# Altium project 243-436_PCB-Support-STM32F407.PrjPcb (part 1 of 2)
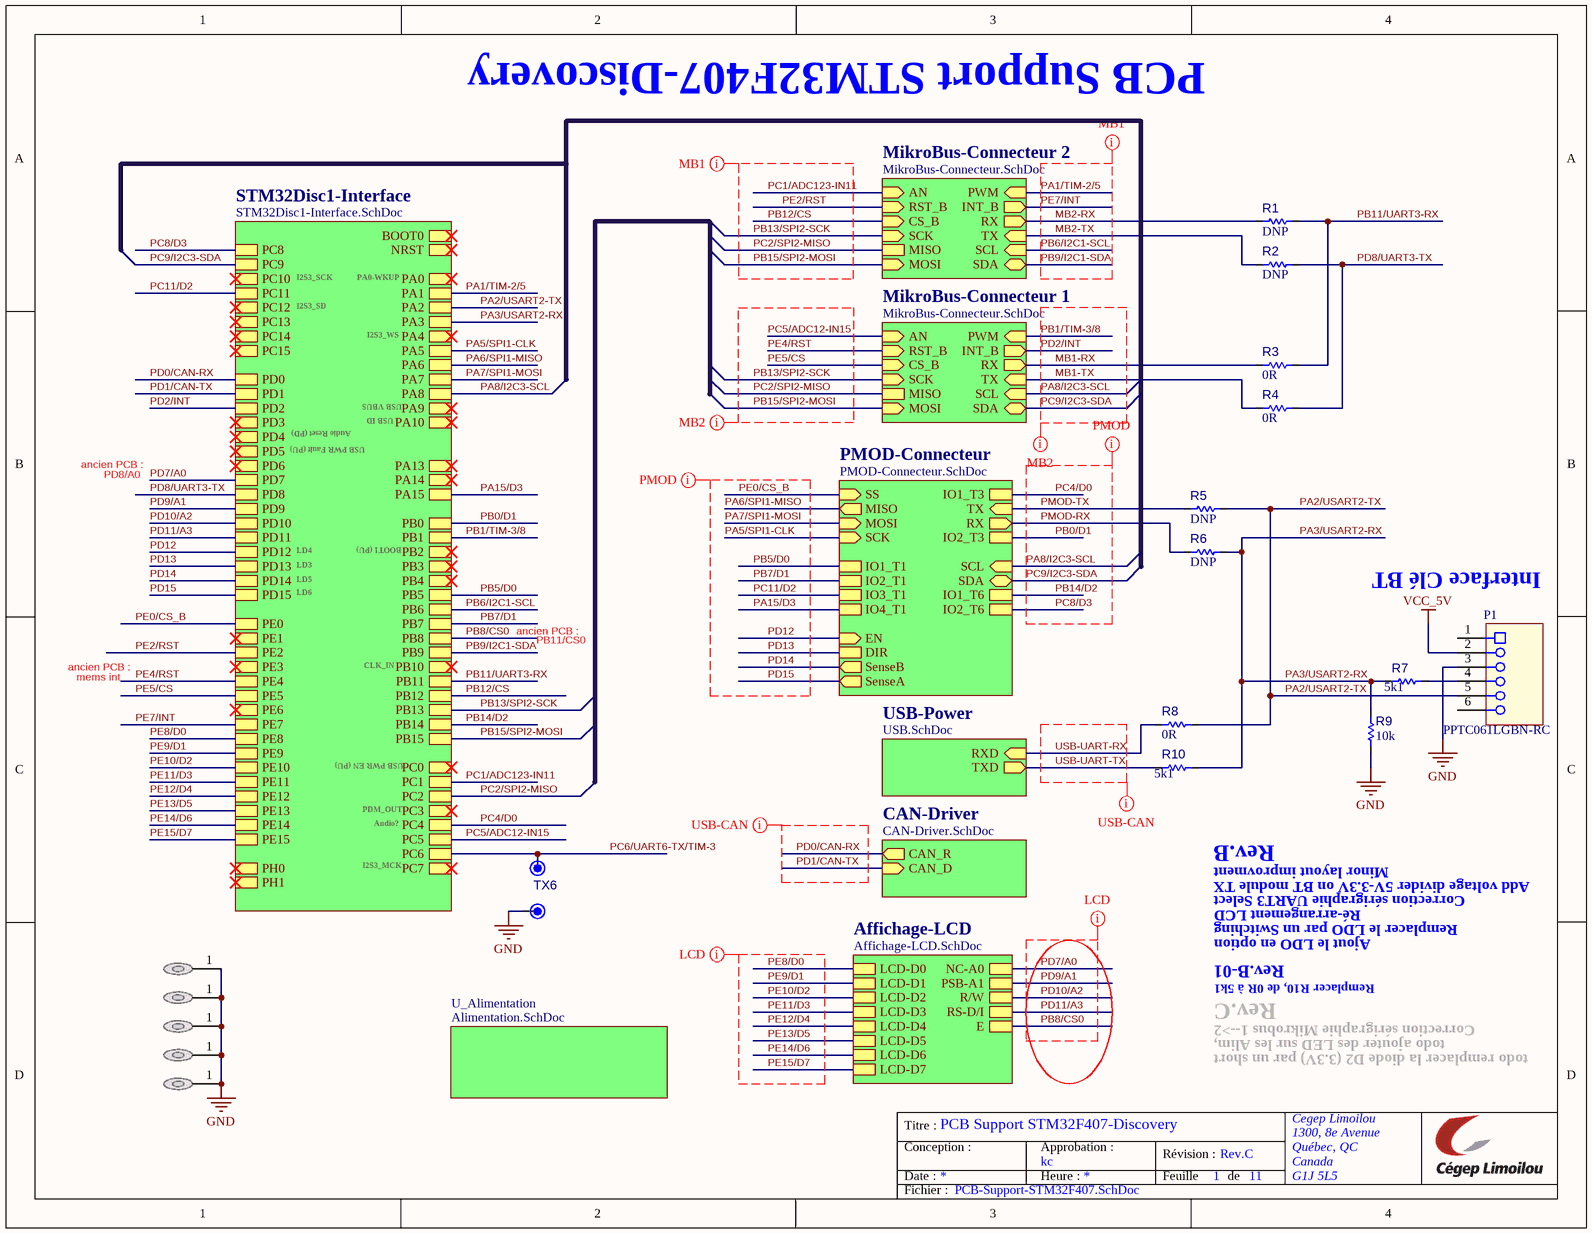
[diagram p0: PCB-Support-STM32F407.SchDoc]
NomDeLetudiant: CEGEP Limoilou; NomDeProjet: STM32F407-Disc-PCB-Support; Revision: Rev.C
11 sheets, 146 parts. Net scope: hierarchical (ports join the sheet entries above them; power ports are global).
Board files: PCB-Support-STM32F407.PcbDoc, PCB-Support-STM32F407-2layers-polygon-EMI.PcbDoc
Sheets:
  PCB-Support-STM32F407.SchDoc
    STM32Disc1-Interface = STM32Disc1-Interface.SchDoc
    MikroBus-Connecteur 2 = MikroBus-Connecteur.SchDoc
    MikroBus-Connecteur 1 = MikroBus-Connecteur.SchDoc
    USB-Power = USB.SchDoc
    CAN-Driver = CAN-Driver.SchDoc
    PMOD-Connecteur = PMOD-Connecteur.SchDoc
    Affichage-LCD = Affichage-LCD.SchDoc
      LCD-Connecteur-KS0108 = LCD-Connecteur-KS0108.SchDoc
      LCD-Connecteur-ST7920 = LCD-Connecteur-ST7920.SchDoc
      Level-Translator1 = Level-Translator.SchDoc
      Level-Translator2 = Level-Translator.SchDoc
    U_Alimentation = Alimentation.SchDoc

## Sheet PCB-Support-STM32F407.SchDoc: PCB Support STM32F407-Discovery
size Letter; ApprovedBy: kc; Author: CEGEP Limoilou; Organization: Cegep Limoilou; Address1: 1300, 8e Avenue; Address2: Québec, QC; Address3: Canada; Address4: G1J 5L5; SheetNumber: 1; SheetTotal: 11

### Parts
(Parts that share a designator on the sheet are numbered #1, #2 ... from top to bottom, then left to right.)
GND3  GND  [TP_TH061]  (value not drawn)  (no BOM)
MH1  DNP  [MP_M-Hole_#4-40_LOOSE-FIT]  (value not drawn)  (no BOM)
MH2  DNP  [MP_M-Hole_#4-40_LOOSE-FIT]  (value not drawn)  (no BOM)
MH3  DNP  [MP_M-Hole_#4-40_LOOSE-FIT]  (value not drawn)  (no BOM)
MH4  DNP  [MP_M-Hole_#4-40_LOOSE-FIT]  (value not drawn)  (no BOM)
MH5  DNP  [MP_M-Hole_#4-40_LOOSE-FIT]  (value not drawn)  (no BOM)
P1  PPTC061LGBN-RC  [P_CONN_HDR_1ROW_6POS_RA_100MIL]
R1  value DNP  [R_1005[0402]]  (hidden comment: Res 0R 0402)  (no BOM)
R2  value DNP  [R_1005[0402]]  (hidden comment: Res 0R 0402)  (no BOM)
R3  value 0R  [R_1005[0402]]  (hidden comment: Res 0R 0402)
R4  value 0R  [R_1005[0402]]  (hidden comment: Res 0R 0402)
R5  value DNP  [R_1005[0402]]  (hidden comment: Res 0R 0402)  (no BOM)
R6  value DNP  [R_1005[0402]]  (hidden comment: Res 0R 0402)  (no BOM)
R7  value 5k1  [R_1005[0402]]  (hidden comment: Res 5k1 1% 0402)
R8  value 0R  [R_1005[0402]]  (hidden comment: Res 0R 0402)
R9  value 10k  [R_1005[0402]]  (hidden comment: Res 10k 1% 0402)
R10#1  value 5k1  [R_1005[0402]]  (hidden comment: Res 5k1 1% 0402)
TX6  DNP  [TP_TH061]  (value not drawn)  (no BOM)

### Sub-sheets
Affichage-LCD = Affichage-LCD.SchDoc: LCD-D0, LCD-D1, LCD-D2, LCD-D3, LCD-D4, LCD-D5, LCD-D6, LCD-D7, NC-A0, PSB-A1, R/W, RS-D/I, E
CAN-Driver = CAN-Driver.SchDoc: CAN_D (in), CAN_R (out)
MikroBus-Connecteur 1 = MikroBus-Connecteur.SchDoc: AN (in), RST_B (in), CS_B (in), SCK (in), MISO, MOSI (in), PWM (in), INT_B (out), RX (out), TX (in), SCL (in), SDA (bidir)
MikroBus-Connecteur 2 = MikroBus-Connecteur.SchDoc: AN (in), RST_B (in), CS_B (in), SCK (in), MISO, MOSI (in), PWM (in), INT_B (out), RX (out), TX (in), SCL (in), SDA (bidir)
PMOD-Connecteur = PMOD-Connecteur.SchDoc: SS (in), MOSI (in), SCK (in), MISO (out), TX (in), RX (out), SCL (in), SDA (bidir), IO1_T3, IO2_T3, IO1_T6, IO2_T6, EN (in), SenseA (out), DIR, SenseB (out), IO1_T1, IO2_T1, IO3_T1, IO4_T1
STM32Disc1-Interface = STM32Disc1-Interface.SchDoc: BOOT0, NRST, PA0, PA1, PA2, PA3, PA4, PA5, PA6, PA7, PA8, PA9, PA10, PA13, PA14, PA15, PB0, PB1, PB2, PB3, PB4, PB5, PB6, PB7, PB8, PB9, PB10, PB11, PB12, PB13, PB14, PB15, PC0, PC1, PC2, PC3, PC4, PC5, PC6, PC7, PC8, PC9, PC10, PC11, PC12, PC13, PC14, PC15, PD0, PD1, PD2, PD3, PD4, PD5, PD6, PD7, PD8, PD9, PD10, PD11, PD12, PD13, PD14, PD15, PE0, PE1, PE2, PE3, PE4, PE5, PE6, PE7, PE8, PE9, PE10, PE11, PE12, PE13, PE14, PE15, PH0, PH1
U_Alimentation = Alimentation.SchDoc: no entries
USB-Power = USB.SchDoc: RXD (in), TXD (out)

### Nets
GND: GND3.1 MH1.1 MH2.1 MH3.1 MH4.1 MH5.1 P1.3 R9.1
VCC_5V: P1.2
MB1-RX: R3.1 ; sheet MikroBus-Connecteur 1/RX
MB1-TX: R4.1 ; sheet MikroBus-Connecteur 1/TX
MB2-RX: R1.1 ; sheet MikroBus-Connecteur 2/RX
MB2-TX: R2.1 ; sheet MikroBus-Connecteur 2/TX
PA1/TIM-2/5: sheet STM32Disc1-Interface/PA1, sheet MikroBus-Connecteur 2/PWM
PA2/USART2-TX: P1.5 R5.2 R8.2 ; sheet STM32Disc1-Interface/PA2
PA3/USART2-RX: R6.2 R7.1 R9.2 R10#1.2 ; sheet STM32Disc1-Interface/PA3
PA5/SPI1-CLK: sheet STM32Disc1-Interface/PA5, sheet PMOD-Connecteur/SCK
PA6/SPI1-MISO: sheet STM32Disc1-Interface/PA6, sheet PMOD-Connecteur/MISO
PA7/SPI1-MOSI: sheet STM32Disc1-Interface/PA7, sheet PMOD-Connecteur/MOSI
PA8/I2C3-SCL: sheet STM32Disc1-Interface/PA8, sheet MikroBus-Connecteur 1/SCL, sheet PMOD-Connecteur/SCL
PA15/D3: sheet STM32Disc1-Interface/PA15, sheet PMOD-Connecteur/IO4_T1
PB0/D1: sheet STM32Disc1-Interface/PB0, sheet PMOD-Connecteur/IO2_T3
PB1/TIM-3/8: sheet STM32Disc1-Interface/PB1, sheet MikroBus-Connecteur 1/PWM
PB5/D0: sheet STM32Disc1-Interface/PB5, sheet PMOD-Connecteur/IO1_T1
PB6/I2C1-SCL: sheet STM32Disc1-Interface/PB6, sheet MikroBus-Connecteur 2/SCL
PB7/D1: sheet STM32Disc1-Interface/PB7, sheet PMOD-Connecteur/IO2_T1
PB8/CS0: sheet STM32Disc1-Interface/PB8, sheet Affichage-LCD/E
PB9/I2C1-SDA: sheet STM32Disc1-Interface/PB9, sheet MikroBus-Connecteur 2/SDA
PB11/UART3-RX: R1.2 R3.2 ; sheet STM32Disc1-Interface/PB11
PB12/CS: sheet STM32Disc1-Interface/PB12, sheet MikroBus-Connecteur 2/CS_B
PB13/SPI2-SCK: sheet STM32Disc1-Interface/PB13, sheet MikroBus-Connecteur 2/SCK, sheet MikroBus-Connecteur 1/SCK
PB14/D2: sheet STM32Disc1-Interface/PB14, sheet PMOD-Connecteur/IO1_T6
PB15/SPI2-MOSI: sheet STM32Disc1-Interface/PB15, sheet MikroBus-Connecteur 2/MOSI, sheet MikroBus-Connecteur 1/MOSI
PC1/ADC123-IN11: sheet STM32Disc1-Interface/PC1, sheet MikroBus-Connecteur 2/AN
PC2/SPI2-MISO: sheet STM32Disc1-Interface/PC2, sheet MikroBus-Connecteur 2/MISO, sheet MikroBus-Connecteur 1/MISO
PC4/D0: sheet STM32Disc1-Interface/PC4, sheet PMOD-Connecteur/IO1_T3
PC5/ADC12-IN15: sheet STM32Disc1-Interface/PC5, sheet MikroBus-Connecteur 1/AN
PC6/UART6-TX/TIM-3: TX6.1 ; sheet STM32Disc1-Interface/PC6
PC8/D3: sheet STM32Disc1-Interface/PC8, sheet PMOD-Connecteur/IO2_T6
PC9/I2C3-SDA: sheet STM32Disc1-Interface/PC9, sheet MikroBus-Connecteur 1/SDA, sheet PMOD-Connecteur/SDA
PC11/D2: sheet STM32Disc1-Interface/PC11, sheet PMOD-Connecteur/IO3_T1
PD0/CAN-RX: sheet STM32Disc1-Interface/PD0, sheet CAN-Driver/CAN_R
PD1/CAN-TX: sheet STM32Disc1-Interface/PD1, sheet CAN-Driver/CAN_D
PD2/INT: sheet STM32Disc1-Interface/PD2, sheet MikroBus-Connecteur 1/INT_B
PD7/A0: sheet STM32Disc1-Interface/PD7, sheet Affichage-LCD/NC-A0
PD8/UART3-TX: R2.2 R4.2 ; sheet STM32Disc1-Interface/PD8
PD9/A1: sheet STM32Disc1-Interface/PD9, sheet Affichage-LCD/PSB-A1
PD10/A2: sheet STM32Disc1-Interface/PD10, sheet Affichage-LCD/R/W
PD11/A3: sheet STM32Disc1-Interface/PD11, sheet Affichage-LCD/RS-D/I
PD12: sheet STM32Disc1-Interface/PD12, sheet PMOD-Connecteur/EN
PD13: sheet STM32Disc1-Interface/PD13, sheet PMOD-Connecteur/DIR
PD14: sheet STM32Disc1-Interface/PD14, sheet PMOD-Connecteur/SenseB
PD15: sheet STM32Disc1-Interface/PD15, sheet PMOD-Connecteur/SenseA
PE0/CS_B: sheet STM32Disc1-Interface/PE0, sheet PMOD-Connecteur/SS
PE2/RST: sheet STM32Disc1-Interface/PE2, sheet MikroBus-Connecteur 2/RST_B
PE4/RST: sheet STM32Disc1-Interface/PE4, sheet MikroBus-Connecteur 1/RST_B
PE5/CS: sheet STM32Disc1-Interface/PE5, sheet MikroBus-Connecteur 1/CS_B
PE7/INT: sheet STM32Disc1-Interface/PE7, sheet MikroBus-Connecteur 2/INT_B
PE8/D0: sheet STM32Disc1-Interface/PE8, sheet Affichage-LCD/LCD-D0
PE9/D1: sheet STM32Disc1-Interface/PE9, sheet Affichage-LCD/LCD-D1
PE10/D2: sheet STM32Disc1-Interface/PE10, sheet Affichage-LCD/LCD-D2
PE11/D3: sheet STM32Disc1-Interface/PE11, sheet Affichage-LCD/LCD-D3
PE12/D4: sheet STM32Disc1-Interface/PE12, sheet Affichage-LCD/LCD-D4
PE13/D5: sheet STM32Disc1-Interface/PE13, sheet Affichage-LCD/LCD-D5
PE14/D6: sheet STM32Disc1-Interface/PE14, sheet Affichage-LCD/LCD-D6
PE15/D7: sheet STM32Disc1-Interface/PE15, sheet Affichage-LCD/LCD-D7
PMOD-RX: R6.1 ; sheet PMOD-Connecteur/RX
PMOD-TX: R5.1 ; sheet PMOD-Connecteur/TX
USB-UART-RX: R8.1 ; sheet USB-Power/RXD
USB-UART-TX: R10#1.1 ; sheet USB-Power/TXD
NetP1_4: P1.4 R7.2

Not connected (* = marked no-connect by the designer): P1 1 6

### Layout directives
net class USB-CAN: PD0/CAN-RX, PD1/CAN-TX, USB-UART-RX, USB-UART-TX
net class LCD: PB8/CS0, PD7/A0, PD9/A1, PD10/A2, PD11/A3, PE8/D0, PE9/D1, PE10/D2, PE11/D3, PE12/D4, PE13/D5, PE14/D6, PE15/D7
net class PMOD: PA5/SPI1-CLK, PA6/SPI1-MISO, PA7/SPI1-MOSI, PA8/I2C3-SCL, PA15/D3, PB0/D1, PB5/D0, PB7/D1, PB14/D2, PC4/D0, PC8/D3, PC9/I2C3-SDA, PC11/D2, PD12, PD13, PD14, PD15, PE0/CS_B, PMOD-RX, PMOD-TX
net class MB2: MB1-RX, MB1-TX, PA8/I2C3-SCL, PB1/TIM-3/8, PB13/SPI2-SCK, PB15/SPI2-MOSI, PC2/SPI2-MISO, PC5/ADC12-IN15, PC9/I2C3-SDA, PD2/INT, PE4/RST, PE5/CS
net class MB1: MB2-RX, MB2-TX, PA1/TIM-2/5, PB6/I2C1-SCL, PB9/I2C1-SDA, PB12/CS, PB13/SPI2-SCK, PB15/SPI2-MOSI, PC1/ADC123-IN11, PC2/SPI2-MISO, PE2/RST, PE7/INT

### Notes on the sheet
- I2S3_SCK
- I2S3_SD
- PA0-WKUP
- I2S3_WS
- PD8/A0
- ancien PCB :
- USB PWR Fault (PU)
- Audio Reset (PD)
- USB VBUS
- USB ID
- LD3
- LD4
- LD5
- LD6
- BOOT1 (PU)
- (near P1) Interface Clé BT
- mems int
- CLK_IN
- PB11/CS0
- USB PWR EN (PU)
- PDM_OUT
- Audio?
- I2S3_MCK
- Rev.B
- Minor layout improvment
- Add voltage divider 5V-3.3V on BT module TX
- Correction sérigraphie UART3 Select
- Ré-arrangement LCD
- Remplacer le LDO par un Switching
- Ajout le LDO en option
- Rev.C
- Correction sérigraphie Mikrobus 1-->2
- Rev.B-01
- Remplacer R10, de 0R à 5k1
- todo ajouter des LED sur les Alim,
- todo remplacer la diode D2 (3.3V) par un short
- Titre :
- Conception :
- Date :
- Approbation :
- Heure :
- Révision :
- Feuille
- de
- Fichier :

### Library data of the parts
GND3 = TP_TH0.61mm(AWG28): Pad TH 0.61mm diameter (AWG28); Value: DNP; Manufacturer Part Number 1: DNP; Supplier Part Number 1: N/A; Supplier 1: N/A
MH1-MH5 = MH-4-40: Mounting Hole #4-40 w/ Flat Washer; Manufacturer Part Number 1: DNP; Value: DNP; Supplier Part Number 1: N/A
P1 = CONN-100MIL-SKT-01X06_RA: CONN SOCKET 6pos 100mils Right Angle; Manufacturer 1: Megastar; Manufacturer Part Number 1: ZX-PM2.54-1-6PWZ; Mounting Technology: TH; Manufacturer 2: Sullins; Manufacturer Part Number 2: PPTC061LGBN-RC; Supplier 1: LCSC; Supplier Part Number 1: C49326178; Manufacturer 3: Samtec; Manufacturer Part Number 3: SSW-106-02-T-S-RA; Supplier 2: Digikey; Supplier Part Number 2: S5442-ND
R1-R6 R8 = RES005: Resistor type 1; Manufacturer 1: Yageo; Manufacturer Part Number 1: RC0402JR-070RL; LibRef: RES005; Max Working Voltage: 50V; Mounting Technology: SMT; Supplier 1: LCSC; Supplier Part Number 1: C60485
R7 R10#1 = RES010: Resistor type 1; Manufacturer 1: Panasonic; Manufacturer Part Number 1: ERJ-2RKF5101X; LibRef: RES010; Puissance: 1/16W; Max Working Voltage: 50V; Tolerance: 1%; Mounting Technology: SMT; Supplier 1: LCSC; Supplier Part Number 1: C25905
R9 = RES003: Resistor type 1; Manufacturer 1: Vishay; Manufacturer Part Number 1: CR0402F1002T1LF; LibRef: RES003; Puissance: 1/16W; Max Working Voltage: 50V; Tolerance: 1%; Mounting Technology: SMT; Supplier 1: Digikey; Supplier Part Number 1: 541-10.0KLCT-ND
TX6 = TP_TH0.61mm(AWG28): Pad TH 0.61mm diameter (AWG28); Value: DNP; Manufacturer Part Number 1: DNP; Supplier Part Number 1: N/A; Supplier 1: N/A

## Sheet STM32Disc1-Interface.SchDoc: STM32 DISCOVERY 407
size Letter; ApprovedBy: APPROUVÉ PAR; Author: CEGEP Limoilou; Organization: Cegep Limoilou; Address1: 1300, 8e Avenue; Address2: Québec, QC; Address3: Canada; Address4: G1J 5L5; SheetNumber: 3; SheetTotal: 8
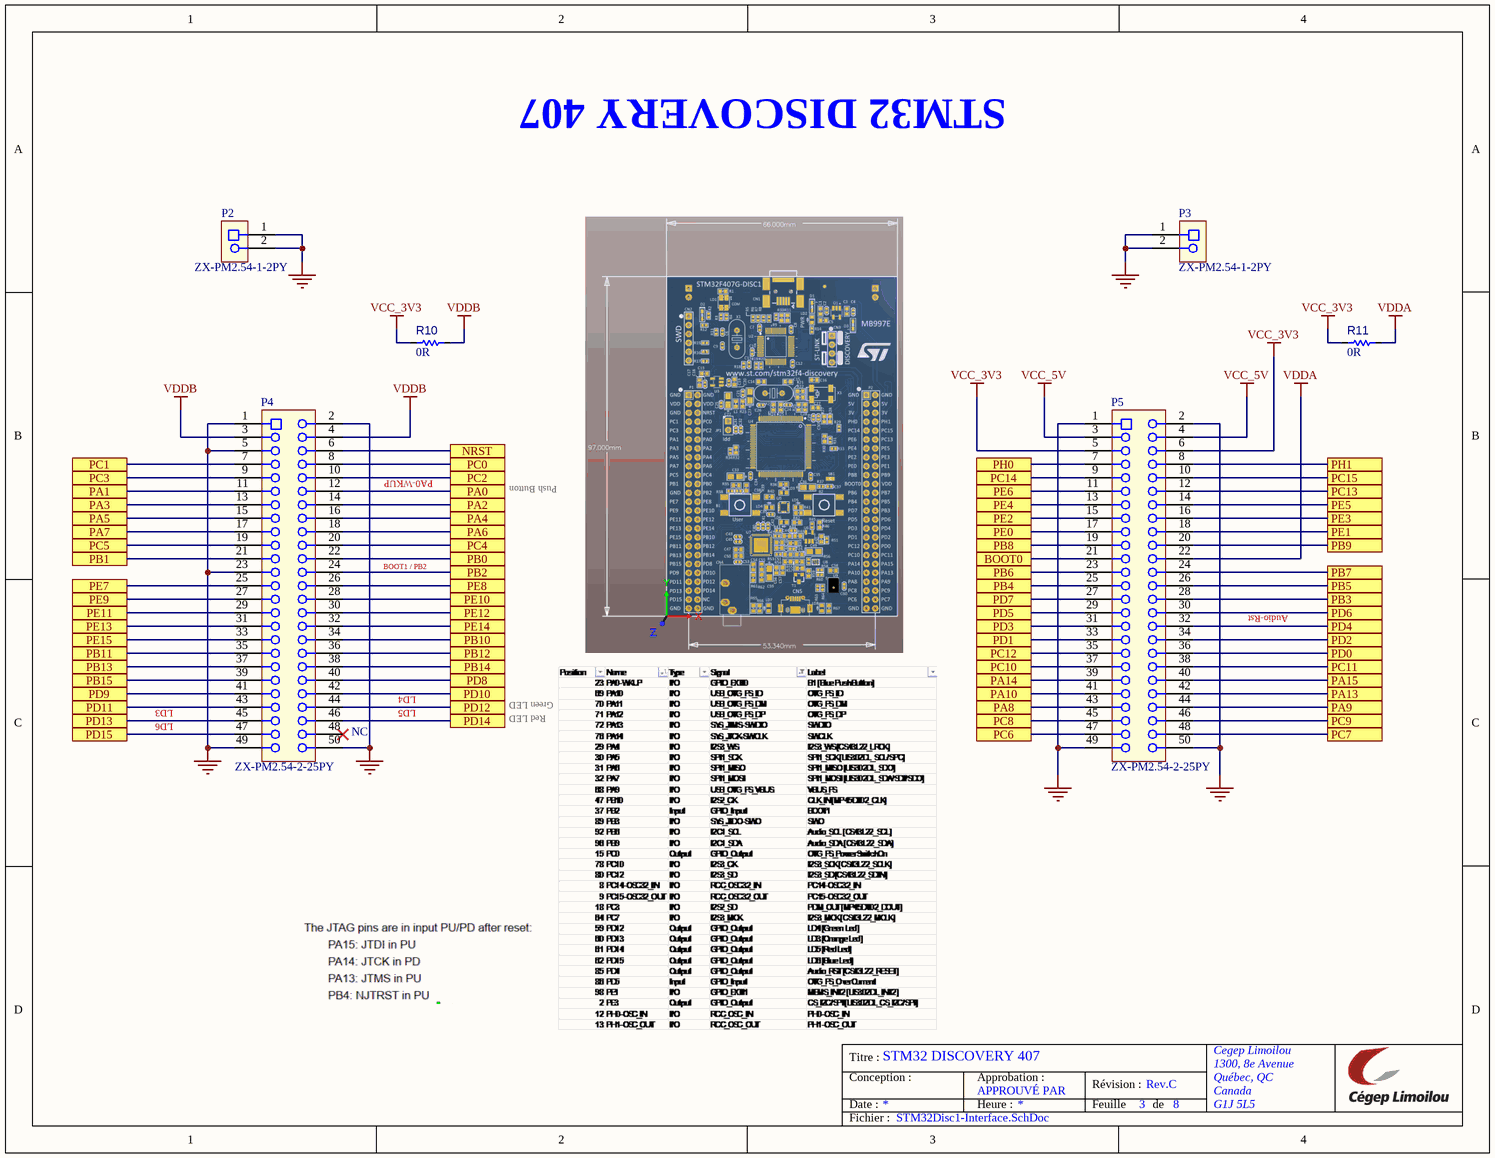
[diagram p1: STM32Disc1-Interface.SchDoc]

### Parts
(Parts that share a designator on the sheet are numbered #1, #2 ... from top to bottom, then left to right.)
P2  ZX-PM2.54-1-2PY  [CONN_SKT_2POS_100MILS_TH]
P3  ZX-PM2.54-1-2PY  [CONN_SKT_2POS_100MILS_TH]
P4  ZX-PM2.54-2-25PY  [CONN-HEAD02X25-100MIL]
P5  ZX-PM2.54-2-25PY  [CONN-HEAD02X25-100MIL]
R10#2  value 0R  [R_1005[0402]]  (hidden comment: Res 0R 0402)
R11  value 0R  [R_1005[0402]]  (hidden comment: Res 0R 0402)

### Ports
BOOT0 (see PCB-Support-STM32F407[2A]), NRST (see PCB-Support-STM32F407[2A]), PA0 (see PCB-Support-STM32F407[2A]), PA1 (see PCB-Support-STM32F407[2A]), PA2 (see PCB-Support-STM32F407[2A]), PA3 (see PCB-Support-STM32F407[2B]), PA4 (see PCB-Support-STM32F407[2B]), PA5 (see PCB-Support-STM32F407[2B]), PA6 (see PCB-Support-STM32F407[2B]), PA7 (see PCB-Support-STM32F407[2B]), PA8 (see PCB-Support-STM32F407[2B]), PA9 (see PCB-Support-STM32F407[2B]), PA10 (see PCB-Support-STM32F407[2B]), PA13 (see PCB-Support-STM32F407[2B]), PA14 (see PCB-Support-STM32F407[2B]), PA15 (see PCB-Support-STM32F407[2B]), PB0 (see PCB-Support-STM32F407[2B]), PB1 (see PCB-Support-STM32F407[2B]), PB2 (see PCB-Support-STM32F407[2B]), PB3 (see PCB-Support-STM32F407[2B]), PB4 (see PCB-Support-STM32F407[2B]), PB5 (see PCB-Support-STM32F407[2B]), PB6 (see PCB-Support-STM32F407[2B]), PB7 (see PCB-Support-STM32F407[2C]), PB8 (see PCB-Support-STM32F407[2C]), PB9 (see PCB-Support-STM32F407[2C]), PB10 (see PCB-Support-STM32F407[2C]), PB11 (see PCB-Support-STM32F407[2C]), PB12 (see PCB-Support-STM32F407[2C]), PB13 (see PCB-Support-STM32F407[2C]), PB14 (see PCB-Support-STM32F407[2C]), PB15 (see PCB-Support-STM32F407[2C]), PC0 (see PCB-Support-STM32F407[2C]), PC1 (see PCB-Support-STM32F407[2C]), PC2 (see PCB-Support-STM32F407[2C]), PC3 (see PCB-Support-STM32F407[2C]), PC4 (see PCB-Support-STM32F407[2C]), PC5 (see PCB-Support-STM32F407[2C]), PC6 (see PCB-Support-STM32F407[2C]), PC7 (see PCB-Support-STM32F407[2C]), PC8 (see PCB-Support-STM32F407[1A]), PC9 (see PCB-Support-STM32F407[1A]), PC10 (see PCB-Support-STM32F407[1A]), PC11 (see PCB-Support-STM32F407[1A]), PC12 (see PCB-Support-STM32F407[1A]), PC13 (see PCB-Support-STM32F407[1B]), PC14 (see PCB-Support-STM32F407[1B]), PC15 (see PCB-Support-STM32F407[1B]), PD0 (see PCB-Support-STM32F407[1B]), PD1 (see PCB-Support-STM32F407[1B]), PD2 (see PCB-Support-STM32F407[1B]), PD3 (see PCB-Support-STM32F407[1B]), PD4 (see PCB-Support-STM32F407[1B]), PD5 (see PCB-Support-STM32F407[1B]), PD6 (see PCB-Support-STM32F407[1B]), PD7 (see PCB-Support-STM32F407[1B]), PD8 (see PCB-Support-STM32F407[1B]), PD9 (see PCB-Support-STM32F407[1B]), PD10 (see PCB-Support-STM32F407[1B]), PD11 (see PCB-Support-STM32F407[1B]), PD12 (see PCB-Support-STM32F407[1B]), PD13 (see PCB-Support-STM32F407[1B]), PD14 (see PCB-Support-STM32F407[1B]), PD15 (see PCB-Support-STM32F407[1B]), PE0 (see PCB-Support-STM32F407[1C]), PE1 (see PCB-Support-STM32F407[1C]), PE2 (see PCB-Support-STM32F407[1C]), PE3 (see PCB-Support-STM32F407[1C]), PE4 (see PCB-Support-STM32F407[1C]), PE5 (see PCB-Support-STM32F407[1C]), PE6 (see PCB-Support-STM32F407[1C]), PE7 (see PCB-Support-STM32F407[1C]), PE8 (see PCB-Support-STM32F407[1C]), PE9 (see PCB-Support-STM32F407[1C]), PE10 (see PCB-Support-STM32F407[1C]), PE11 (see PCB-Support-STM32F407[1C]), PE12 (see PCB-Support-STM32F407[1C]), PE13 (see PCB-Support-STM32F407[1C]), PE14 (see PCB-Support-STM32F407[1C]), PE15 (see PCB-Support-STM32F407[1C]), PH0 (see PCB-Support-STM32F407[1C]), PH1 (see PCB-Support-STM32F407[1C])

### Nets
GND: P2.1 P2.2 P3.1 P3.2 P4.1 P4.2 P4.5 P4.23 P4.49 P4.50 P5.1 P5.2 P5.49 P5.50
VCC_3V3: P5.5 P5.6 R10#2.1 R11.1
VCC_5V: P5.3 P5.4
VDDA: P5.22 R11.2
VDDB: P4.3 P4.4 R10#2.2
PA1/TIM-2/5: P4.11 ; port PA1
PA2/USART2-TX: P4.14 ; port PA2
PA3/USART2-RX: P4.13 ; port PA3
PA5/SPI1-CLK: P4.15 ; port PA5
PA6/SPI1-MISO: P4.18 ; port PA6
PA7/SPI1-MOSI: P4.17 ; port PA7
PA8/I2C3-SCL: P5.43 ; port PA8
PA15/D3: P5.40 ; port PA15
PB0/D1: P4.22 ; port PB0
PB1/TIM-3/8: P4.21 ; port PB1
PB5/D0: P5.26 ; port PB5
PB6/I2C1-SCL: P5.23 ; port PB6
PB7/D1: P5.24 ; port PB7
PB8/CS0: P5.19 ; port PB8
PB9/I2C1-SDA: P5.20 ; port PB9
PB11/UART3-RX: P4.35 ; port PB11
PB12/CS: P4.36 ; port PB12
PB13/SPI2-SCK: P4.37 ; port PB13
PB14/D2: P4.38 ; port PB14
PB15/SPI2-MOSI: P4.39 ; port PB15
PC1/ADC123-IN11: P4.7 ; port PC1
PC2/SPI2-MISO: P4.10 ; port PC2
PC4/D0: P4.20 ; port PC4
PC5/ADC12-IN15: P4.19 ; port PC5
PC6/UART6-TX/TIM-3: P5.47 ; port PC6
PC8/D3: P5.45 ; port PC8
PC9/I2C3-SDA: P5.46 ; port PC9
PC11/D2: P5.38 ; port PC11
PD0/CAN-RX: P5.36 ; port PD0
PD1/CAN-TX: P5.33 ; port PD1
PD2/INT: P5.34 ; port PD2
PD7/A0: P5.27 ; port PD7
PD8/UART3-TX: P4.40 ; port PD8
PD9/A1: P4.41 ; port PD9
PD10/A2: P4.42 ; port PD10
PD11/A3: P4.43 ; port PD11
PD12: P4.44 ; port PD12
PD13: P4.45 ; port PD13
PD14: P4.46 ; port PD14
PD15: P4.47 ; port PD15
PE0/CS_B: P5.17 ; port PE0
PE2/RST: P5.15 ; port PE2
PE4/RST: P5.13 ; port PE4
PE5/CS: P5.14 ; port PE5
PE7/INT: P4.25 ; port PE7
PE8/D0: P4.26 ; port PE8
PE9/D1: P4.27 ; port PE9
PE10/D2: P4.28 ; port PE10
PE11/D3: P4.29 ; port PE11
PE12/D4: P4.30 ; port PE12
PE13/D5: P4.31 ; port PE13
PE14/D6: P4.32 ; port PE14
PE15/D7: P4.33 ; port PE15
NetP4_6: P4.6 ; port NRST
NetP4_8: P4.8 ; port PC0
NetP4_9: P4.9 ; port PC3
NetP4_12: P4.12 ; port PA0
NetP4_16: P4.16 ; port PA4
NetP4_24: P4.24 ; port PB2
NetP4_34: P4.34 ; port PB10
NetP5_7: P5.7 ; port PH0
NetP5_8: P5.8 ; port PH1
NetP5_9: P5.9 ; port PC14
NetP5_10: P5.10 ; port PC15
NetP5_11: P5.11 ; port PE6
NetP5_12: P5.12 ; port PC13
NetP5_16: P5.16 ; port PE3
NetP5_18: P5.18 ; port PE1
NetP5_21: P5.21 ; port BOOT0
NetP5_25: P5.25 ; port PB4
NetP5_28: P5.28 ; port PB3
NetP5_29: P5.29 ; port PD5
NetP5_30: P5.30 ; port PD6
NetP5_31: P5.31 ; port PD3
NetP5_32: P5.32 ; port PD4
NetP5_35: P5.35 ; port PC12
NetP5_37: P5.37 ; port PC10
NetP5_39: P5.39 ; port PA14
NetP5_41: P5.41 ; port PA10
NetP5_42: P5.42 ; port PA13
NetP5_44: P5.44 ; port PA9
NetP5_48: P5.48 ; port PC7

Not connected (* = marked no-connect by the designer): P4 48*

### Notes on the sheet
- PA0-WKUP
- Push Button
- BOOT1 / PB2
- Audio-Rst
- LD4
- Green LED
- LD3
- LD6
- (near P4) NC
- LD5
- Red LED
- Titre :
- Conception :
- Date :
- Approbation :
- Heure :
- Révision :
- Feuille
- de
- Fichier :

### Library data of the parts
P2 P3 = CONN-100MIL-SKT-01X02: CONN SOCKET 2pins single row , 100mils TH; Manufacturer 1: Megastar; Manufacturer Part Number 1: ZX-PM2.54-1-2PY; Mounting Technology: TH; Supplier 1: LCSC; Supplier Part Number 1: C7499322; Manufacturer 2: Würth Elektronik; Manufacturer Part Number 2: 61300211121
P4 P5 = CONN-100MIL-SKT-02X25: CONN SOCKET 2x25POS, Dual row 100MIL; Manufacturer 1: Megastar; Manufacturer Part Number 1: ZX-PM2.54-2-25PY; Mounting Technology: TH; Manufacturer 2: Sullins; Manufacturer Part Number 2: SFH11-PBPC-D25-ST-BK; Supplier 1: LCSC; Supplier 2: Digikey; Supplier Part Number 1: C7499355; Supplier Part Number 2: S9201-ND
R10#2 R11 = RES005: as R1 on sheet PCB-Support-STM32F407; Mounting Technology: SMT; Supplier 1: LCSC; Supplier Part Number 1: C60485

## Sheet MikroBus-Connecteur.SchDoc: Mikro Bus - Connecteur
size Letter; ApprovedBy: APPROUVÉ PAR; Author: CEGEP Limoilou; Organization: Cegep Limoilou; Address1: 1300, 8e Avenue; Address2: Québec, QC; Address3: Canada; Address4: G1J 5L5; SheetNumber: 3; SheetTotal: 7
Used 2 times, as channels MikroBus-Connecteur 2, MikroBus-Connecteur 1. Parts and nets are listed once, with the designators drawn on the sheet.
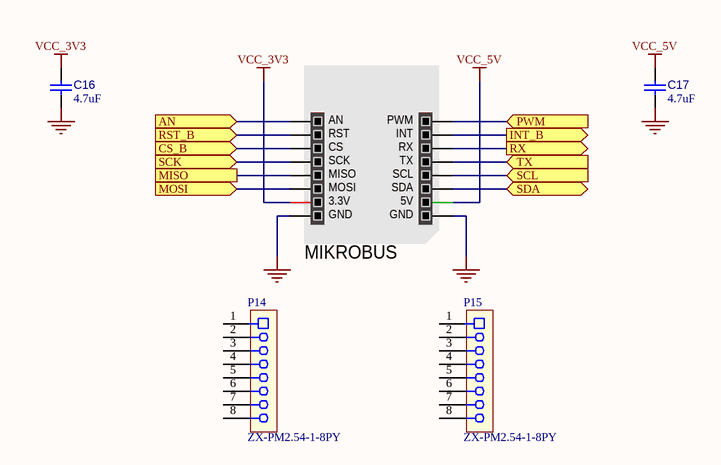
[diagram p2: MikroBus-Connecteur.SchDoc]

### Parts
C16  value 4.7uF  [C_2012[0805]]  (hidden comment: Cap 4.7uF 0805)
C17  value 4.7uF  [C_2012[0805]]  (hidden comment: Cap 4.7uF 0805)
MIKROBUS  MIKROBUS HOST CONN.  [MIKROBUS HOST CONN. TH]  (value not drawn)  (no BOM)
P14  ZX-PM2.54-1-8PY  [CONN_SKT_01X08_100MIL]  (graphical)
P15  ZX-PM2.54-1-8PY  [CONN_SKT_01X08_100MIL]  (graphical)

### Ports
AN (in, see PCB-Support-STM32F407[3B]), CS_B (in, see PCB-Support-STM32F407[3B]), INT_B (out, see PCB-Support-STM32F407[3B]), MISO (see PCB-Support-STM32F407[3B]), MOSI (in, see PCB-Support-STM32F407[3B]), PWM (in, see PCB-Support-STM32F407[3B]), RST_B (in, see PCB-Support-STM32F407[3B]), RX (out, see PCB-Support-STM32F407[3B]), SCK (in, see PCB-Support-STM32F407[3B]), SCL (in, see PCB-Support-STM32F407[3B], PMOD-Connecteur[3C]), SDA (bidir, see PCB-Support-STM32F407[3B], PMOD-Connecteur[3B]), TX (in, see PCB-Support-STM32F407[3B])

### Nets
GND: C16.1 C17.1 MIKROBUS.8(GND) MIKROBUS.9(GND)
VCC_3V3: C16.2 MIKROBUS.7(3.3V)
VCC_5V: C17.2 MIKROBUS.10(5V)
AN: MIKROBUS.1(AN) ; port AN
CS_B: MIKROBUS.3(CS) ; port CS_B
INT_B: MIKROBUS.15(INT) ; port INT_B
MISO: MIKROBUS.5(MISO) ; port MISO
MOSI: MIKROBUS.6(MOSI) ; port MOSI
PWM: MIKROBUS.16(PWM) ; port PWM
RST_B: MIKROBUS.2(RST) ; port RST_B
RX: MIKROBUS.14(RX) ; port RX
SCK: MIKROBUS.4(SCK) ; port SCK
SCL: MIKROBUS.12(SCL) ; port SCL
SDA: MIKROBUS.11(SDA) ; port SDA
TX: MIKROBUS.13(TX) ; port TX

Not connected (* = marked no-connect by the designer): P14 1 2 3 4 5 6 7 8; P15 1 2 3 4 5 6 7 8

### Channels
MikroBus-Connecteur 2: designators C16=C16B C17=C17B MIKROBUS=MIKROBUS1B P14=P14B P15=P15B; ports AN=PC1/ADC123-IN11 CS_B=PB12/CS INT_B=PE7/INT MISO=PC2/SPI2-MISO MOSI=PB15/SPI2-MOSI PWM=PA1/TIM-2/5 RST_B=PE2/RST RX=MB2-RX SCK=PB13/SPI2-SCK SCL=PB6/I2C1-SCL SDA=PB9/I2C1-SDA TX=MB2-TX
MikroBus-Connecteur 1: designators C16=C16A C17=C17A MIKROBUS=MIKROBUS1A P14=P14A P15=P15A; ports AN=PC5/ADC12-IN15 CS_B=PE5/CS INT_B=PD2/INT MISO=PC2/SPI2-MISO MOSI=PB15/SPI2-MOSI PWM=PB1/TIM-3/8 RST_B=PE4/RST RX=MB1-RX SCK=PB13/SPI2-SCK SCL=PA8/I2C3-SCL SDA=PC9/I2C3-SDA TX=MB1-TX

### Notes on the sheet
- Titre :
- Conception :
- Date :
- Approbation :
- Heure :
- Révision :
- Feuille
- de
- Fichier :

### Library data of the parts
C16 C17 = CAP003: Capacitor type 1; Manufacturer 1: Taiyo Yuden; Manufacturer Part Number 1: TMK212AB7475KG-T; LibRef: CAP003; CEGEP: KCOND02SM; Tolerance: 10%; Rated Voltage: 25V; Dielectric: X7R; Supplier 1: LCSC; Supplier Part Number 1: C163186; Mounting Technology: SMT
MIKROBUS = MIKROBUS-HOST-CONN: mikroBUS Host Socket
P14 P15 = CONN-100MIL-SKT-01X08: CONN SOCKET 8pos 100mils; Manufacturer 1: Megastar; Mounting Technology: TH; Manufacturer Part Number 1: ZX-PM2.54-1-8PY; Supplier 1: LCSC; Supplier Part Number 1: C7499328

## Sheet USB.SchDoc: Interface USB et CAN
size Letter; ApprovedBy: APPROUVÉ PAR; Author: CEGEP Limoilou; Organization: Cegep Limoilou; Address1: 1300, 8e Avenue; Address2: Québec, QC; Address3: Canada; Address4: G1J 5L5; SheetNumber: 7; SheetTotal: 7
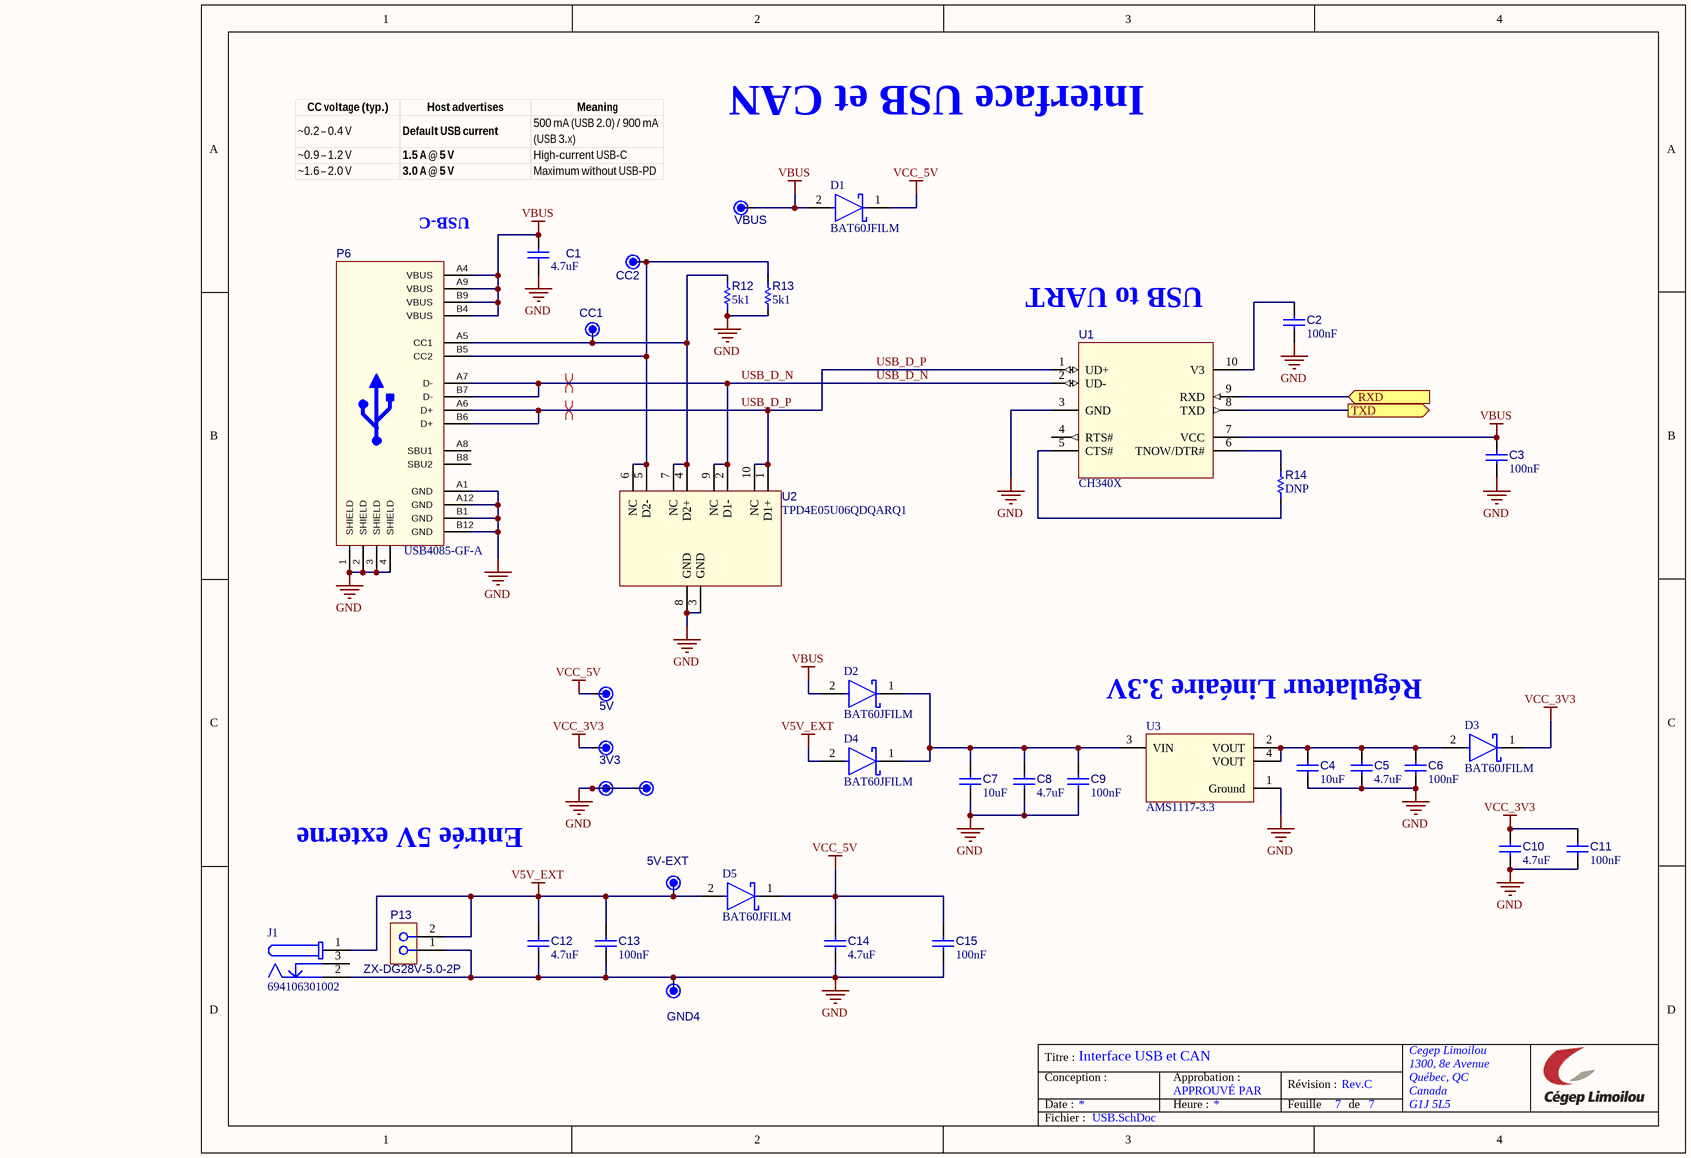
[diagram p3: USB.SchDoc]

### Parts
(Parts that share a designator on the sheet are numbered #1, #2 ... from top to bottom, then left to right.)
3V3#1  DNP  [TP_TH061]  (value not drawn)  (no BOM)
5V#1  DNP  [TP_TH061]  (value not drawn)  (no BOM)
5V-EXT#1  DNP  [TP_TH061]  (value not drawn)  (no BOM)
C1  value 4.7uF  [C_2012[0805]]  (hidden comment: Cap 4.7uF 0805)
C2  value 100nF  [C_1005[0402]]  (hidden comment: Cap 100nF 0402)
C3  value 100nF  [C_1005[0402]]  (hidden comment: Cap 100nF 0402)
C4#1  value 10uF  [C_2012[0805]]  (hidden comment: Cap 10uF 0805)
C5#1  value 4.7uF  [C_2012[0805]]  (hidden comment: Cap 4.7uF 0805)
C6#1  value 100nF  [C_1005[0402]]  (hidden comment: Cap 100nF 0402)
C7#1  value 10uF  [C_2012[0805]]  (hidden comment: Cap 10uF 0805)
C8#1  value 4.7uF  [C_2012[0805]]  (hidden comment: Cap 4.7uF 0805)
C9#1  value 100nF  [C_1005[0402]]  (hidden comment: Cap 100nF 0402)
C10#1  value 4.7uF  [C_2012[0805]]  (hidden comment: Cap 4.7uF 0805)
C11#1  value 100nF  [C_1005[0402]]  (hidden comment: Cap 100nF 0402)
C12#1  value 4.7uF  [C_2012[0805]]  (hidden comment: Cap 4.7uF 0805)
C13#1  value 100nF  [C_1005[0402]]  (hidden comment: Cap 100nF 0402)
C14#1  value 4.7uF  [C_2012[0805]]  (hidden comment: Cap 4.7uF 0805)
C15#1  value 100nF  [C_1005[0402]]  (hidden comment: Cap 100nF 0402)
CC1  DNP  [TP_TH061]  (value not drawn)  (no BOM)
CC2  DNP  [TP_TH061]  (value not drawn)  (no BOM)
D1#1  BAT60JFILM  [SOD323]
D2#1  BAT60JFILM  [SOD323]
D3#1  BAT60JFILM  [SOD323]
D4#1  BAT60JFILM  [SOD323]
D5#1  BAT60JFILM  [SOD323]
GND1#1  GND  [TP_TH061]  (value not drawn)  (no BOM)
GND2#1  GND  [TP_TH061]  (value not drawn)  (no BOM)
GND4#1  GND  [TP_TH061]  (value not drawn)  (no BOM)
J1#1  694106301002  [CONN_DC-JACK_RA]
P6#1  USB4085-GF-A  [FP-USB4085-GF-A-MFG]  (no BOM)
P13  ZX-DG28V-5.0-2P  [CONN_TERM_BLOCK_2POS_5mm_Model1]  (no BOM)
R12  value 5k1  [R_1005[0402]]  (hidden comment: Res 5k1 1% 0402)
R13  value 5k1  [R_1005[0402]]  (hidden comment: Res 5k1 1% 0402)
R14  value DNP  [R_1005[0402]]  (hidden comment: Res 4k7 1% 0402)  (no BOM)
U1  CH340X  [U_MSOP50P300X500-10(RM-10)_WO-TP]
U2  TPD4E05U06QDQARQ1  [U_USON50P250X100-10]
U3#1  AMS1117-3.3  [SOT-223]
VBUS#1  DNP  [TP_TH061]  (value not drawn)  (no BOM)

### Ports
RXD (in, see PCB-Support-STM32F407[3C]), TXD (out, see PCB-Support-STM32F407[3C])

### Nets
GND: C1.1 C2.1 C3.1 C4#1.1 C5#1.1 C6#1.1 C7#1.1 C8#1.1 C9#1.1 C10#1.1 C11#1.1 C12#1.1 C13#1.1 C14#1.1 C15#1.1 GND1#1.1 GND2#1.1 GND4#1.1 J1#1.2 P6#1.1(SHIELD) P6#1.2(SHIELD) P6#1.3(SHIELD) P6#1.4(SHIELD) P6#1.A1(GND) P6#1.A12(GND) P6#1.B1(GND) P6#1.B12(GND) P13.1 R12.1 R13.1 U1.3(GND) U2.3(GND) U2.8(GND) U3#1.1(Ground)
V5V_EXT: 5V-EXT#1.1 C12#1.2 C13#1.2 D4#1.2(A) D5#1.2(A) J1#1.1 P13.2
VBUS: C1.2 C3.2 D1#1.2(A) D2#1.2(A) P6#1.A4(VBUS) P6#1.A9(VBUS) P6#1.B4(VBUS) P6#1.B9(VBUS) U1.7(VCC) VBUS#1.1
VCC_3V3: 3V3#1.1 C10#1.2 C11#1.2 D3#1.1(K)
VCC_5V: 5V#1.1 C14#1.2 C15#1.2 D1#1.1(K) D5#1.1(K)
USB-UART-RX: U1.9(RXD) ; port RXD
USB-UART-TX: U1.8(TXD) ; port TXD
USB_D_N: P6#1.A7(D-) P6#1.B7(D-) U1.2(UD-) U2.2(D1-) U2.9(NC)
USB_D_P: P6#1.A6(D+) P6#1.B6(D+) U1.1(UD+) U2.1(D1+) U2.10(NC)
NetC2_2: C2.2 U1.10(V3)
NetC4#1_2: C4#1.2 C5#1.2 C6#1.2 D3#1.2(A) U3#1.2(VOUT) U3#1.4(VOUT)
NetC7#1_2: C7#1.2 C8#1.2 C9#1.2 D2#1.1(K) D4#1.1(K) U3#1.3(VIN)
NetCC1_1: CC1.1 P6#1.A5(CC1) R12.2 U2.4(D2+) U2.7(NC)
NetCC2_1: CC2.1 P6#1.B5(CC2) R13.2 U2.5(D2-) U2.6(NC)
NetR14_1: R14.1 U1.5(CTS#)
NetR14_2: R14.2 U1.6(TNOW/DTR#)

Not connected (* = marked no-connect by the designer): J1#1 3; P6#1 A8(SBU1) B8(SBU2); U1 4(RTS#)

### Layout directives
differential pair: USB_D_N, USB_D_P

### Notes on the sheet
- (near P6#1) USB-C
- USB to UART
- Régulateur Linéaire 3.3V
- Entrée 5V externe
- Titre :
- Conception :
- Date :
- Approbation :
- Heure :
- Révision :
- Feuille
- de
- Fichier :

### Library data of the parts
3V3#1 5V#1 5V-EXT#1 CC1 CC2 VBUS#1 = TP_TH0.61mm(AWG28): Pad TH 0.61mm diameter (AWG28); Value: DNP; Manufacturer Part Number 1: DNP; Supplier Part Number 1: N/A; Supplier 1: N/A
C1 C5#1 C8#1 C10#1 C12#1 C14#1 = CAP003: as C16 on sheet MikroBus-Connecteur; Supplier 1: LCSC; Supplier Part Number 1: C163186; Mounting Technology: SMT
C2 C3 C6#1 C9#1 C11#1 C13#1 C15#1 = CAP001: Capacitor type 1; Manufacturer 1: Taiyo Yuden; Manufacturer Part Number 1: UMK105B7104KV-FR; LibRef: CAP001; CEGEP: KCOND01SM; Tolerance: 10%; Rated Voltage: 50V; Dielectric: X7R; Mounting Technology: SMT; Supplier 1: LCSC; Supplier Part Number 1: C2167491
C4#1 C7#1 = CAP004: Capacitor type 1; Manufacturer 1: Samsung; Manufacturer Part Number 1: CL21A106KAYNNNE; LibRef: CAP004; CEGEP: KCOND03SM; Tolerance: 10%; Rated Voltage: 25V; Dielectric: X5R; Mounting Technology: SMT; Supplier 1: LCSC; Supplier Part Number 1: C15850
D1#1 D2#1 D3#1 D4#1 D5#1 = D_BAT60: DIODE SCHOTTKY 10V 3A SOD323; Manufacturer 1: ST; Manufacturer Part Number 1: BAT60JFILM; Mounting Technology: SMT; Supplier 1: LCSC; Supplier Part Number 1: C133103
GND1#1 GND2#1 GND4#1 = TP_TH0.61mm(AWG28): as GND3 on sheet PCB-Support-STM32F407; Manufacturer Part Number 1: DNP; Supplier Part Number 1: N/A; Supplier 1: N/A
J1#1 = CONN-DC-JACK-2MM5: DC Barrel Connector 2.5mm; Manufacturer 1: XKB Connection; Manufacturer Part Number 1: DC-005-5A-2.5; Mounting Technology: TH; Supplier 1: LCSC; Supplier Part Number 1: C381115
P6#1 = CONN-USB-C-16POS: CONN RCPT USB2.0 TYPE C RA - TH; Manufacturer 1: Global Connector Technology; Code CEGEP: ? (R13-B182); Manufacturer Part Number 1: USB4085-GF-A; Mounting Technology: TH; Supplier 1: LCSC; Supplier 2: Digikey; Supplier Part Number 1: C7095263; Supplier Part Number 2: 2073-USB4085-GF-ACT-ND
P13 = CONN-5MM-2POS-TERM-BLOCK: CONN TERM BLOCK 2POS 5mm pitch; Manufacturer 1: Megastar; Code CEGEP: CONWECO0002; Supplier 1: LCSC; Supplier Part Number 1: C49022995; Manufacturer Part Number 1: ZX-DG28V-5.0-2P; Mounting Technology: TH; Manufacturer 2: Weidmüller - Phoenix Contact; Manufacturer Part Number 2: 1760510000 - 1890963
R12 R13 = RES010: as R7 on sheet PCB-Support-STM32F407; Tolerance: 1%; Supplier 1: LCSC; Supplier Part Number 1: C25905; Mounting Technology: SMT
R14 = RES007: Resistor type 1; Manufacturer 1: Panasonic; Manufacturer Part Number 1: ERJ-2RKF4701X; LibRef: RES007; Puissance: 1/16W; Max Working Voltage: 50V; Tolerance: 1%; Mounting Technology: SMT; Supplier 1: LCSC; Supplier Part Number 1: C400631
U1 = U_CH340X: IC USB to Serial Port; Manufacturer 1: WCH(Jiangsu Qin Heng); Code CEGEP: KPTSO02; Manufacturer Part Number 1: CH340X; Mounting Technology: SMT; Supplier 1: LCSC; Supplier Part Number 1: C3035748
U2 = U_TPD4E05U06: TVS DIODE 5.5V 14V 10USON; Manufacturer 1: Texas Instruments; Manufacturer 2: ElecSuper; Manufacturer Part Number 2: TPD4E05U06QDQARQ1-ES; Manufacturer Part Number 1: TPD4E05U06QDQARQ1; Mounting Technology: SMT; Supplier 1: LCSC; Supplier 2: Digikey; Supplier Part Number 1: C81353; Supplier Part Number 2: 296-40696-1-ND
U3#1 = U_AMS1117-3.3: LDO Voltage Regulators 1A, 3.3V; Manufacturer 1: UMW; Manufacturer Part Number 1: AMS1117-3.3; Mounting Technology: SMT; Manufacturer 2: Advanced Monolithic Systems; Manufacturer Part Number 2: AMS1117-3.3; Supplier 1: LCSC; Supplier 2: LCSC; Supplier Part Number 1: C347222; Supplier Part Number 2: C6186

## Sheet CAN-Driver.SchDoc: Driver CAN
size Letter; ApprovedBy: APPROUVÉ PAR; Author: CEGEP Limoilou; Organization: Cegep Limoilou; Address1: 1300, 8e Avenue; Address2: Québec, QC; Address3: Canada; Address4: G1J 5L5; SheetNumber: 6; SheetTotal: 7
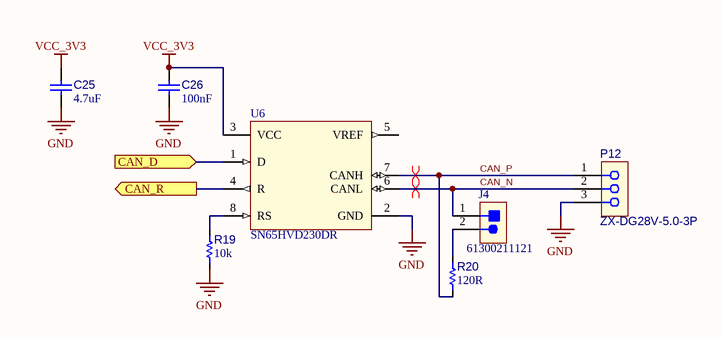
[diagram p4: CAN-Driver.SchDoc]

### Parts
(Parts that share a designator on the sheet are numbered #1, #2 ... from top to bottom, then left to right.)
C25#1  value 4.7uF  [C_2012[0805]]  (hidden comment: Cap 4.7uF 0805)
C26#1  value 100nF  [C_1005[0402]]  (hidden comment: Cap 100nF 0402)
J4  61300211121  [CONN_HDR_2POS_100MILS_TH]
P12  ZX-DG28V-5.0-3P  [CONN_TERM_BLOCK_3POS_5mm_Model1]  (no BOM)
R19  value 10k  [R_1005[0402]]  (hidden comment: Res 10k 1% 0402)
R20  value 120R  [R_3216[1206]]  (hidden comment: Res 120R 1206)
U6#1  SN65HVD230DR  [SOIC-8]

### Ports
CAN_D (in, see PCB-Support-STM32F407[3C]), CAN_R (out, see PCB-Support-STM32F407[3C])

### Nets
GND: C25#1.1 C26#1.1 P12.3 R19.1 U6#1.2(GND)
VCC_3V3: C25#1.2 C26#1.2 U6#1.3(VCC)
CAN_N: J4.1 P12.2 U6#1.6(CANL)
CAN_P: P12.1 R20.1 U6#1.7(CANH)
PD0/CAN-RX: U6#1.4(R) ; port CAN_R
PD1/CAN-TX: U6#1.1(D) ; port CAN_D
NetJ4_2: J4.2 R20.2
NetR19_2: R19.2 U6#1.8(RS)

Not connected (* = marked no-connect by the designer): U6#1 5(VREF)

### Layout directives
differential pair: CAN_N, CAN_P

### Notes on the sheet
- Titre :
- Conception :
- Date :
- Approbation :
- Heure :
- Révision :
- Feuille
- de
- Fichier :

### Library data of the parts
C25#1 = CAP003: as C16 on sheet MikroBus-Connecteur; Supplier 1: LCSC; Supplier Part Number 1: C163186; Mounting Technology: SMT
C26#1 = CAP001: as C2 on sheet USB; Mounting Technology: SMT; Supplier 1: LCSC; Supplier Part Number 1: C2167491
J4 = CONN-100MIL-HDR-01X02: CONN HEADER 2POS 100MIL; Manufacturer 1: Megastar; Manufacturer Part Number 1: ZX-PZ2.54-1-2PZZ; Value: R120; Mounting Technology: TH; Supplier 1: LCSC; Supplier Part Number 1: C7501260; Manufacturer 2: Würth Elektronik; Manufacturer Part Number 2: 61300211121
P12 = CONN-5MM-3POS-TERM-BLOCK: CONN TERM BLOCK 3POS 5mm pitch; Manufacturer 1: Megastar; Value: CAN; Code CEGEP: CONWECO0003; Supplier 1: LCSC; Supplier Part Number 1: ZX-DG28V-5.0-3P; Manufacturer Part Number 1: ZX-DG28V-5.0-3P; Mounting Technology: TH; Manufacturer 2: Weco - Phoenix Contact; Manufacturer Part Number 2: 950-DS/03 - 1890976
R19 = RES003: as R9 on sheet PCB-Support-STM32F407; Tolerance: 1%; Mounting Technology: SMT; Supplier 1: Digikey; Supplier Part Number 1: 541-10.0KLCT-ND
R20 = RES014: Resistor type 1; Manufacturer 1: Yageo; Manufacturer Part Number 1: RC1206FR-07120RL; LibRef: RES014; CEGEP: RESI0043SMT; Tolerance: 1%; Puissance: 1/4W; Max Working Voltage: 200V; Mounting Technology: SMT; Supplier 1: LCSC; Supplier Part Number 1: C114928; Supplier 2: Digikey; Supplier Part Number 2: P120ECT-ND
U6#1 = U_SN65HVD230DR: IC TRANSCEIVER HALF 1/1 8SOIC; Manufacturer 1: TI; Manufacturer Part Number 1: SN65HVD230DR; Mounting Technology: SMT; Supplier 1: LCSC; Supplier Part Number 1: C12084

## Sheet PMOD-Connecteur.SchDoc: Connecteurs - PMOD Interface
size Letter; ApprovedBy: APPROUVÉ PAR; Author: CEGEP Limoilou; Organization: Cegep Limoilou; Address1: 1300, 8e Avenue; Address2: Québec, QC; Address3: Canada; Address4: G1J 5L5; SheetNumber: 4; SheetTotal: 7
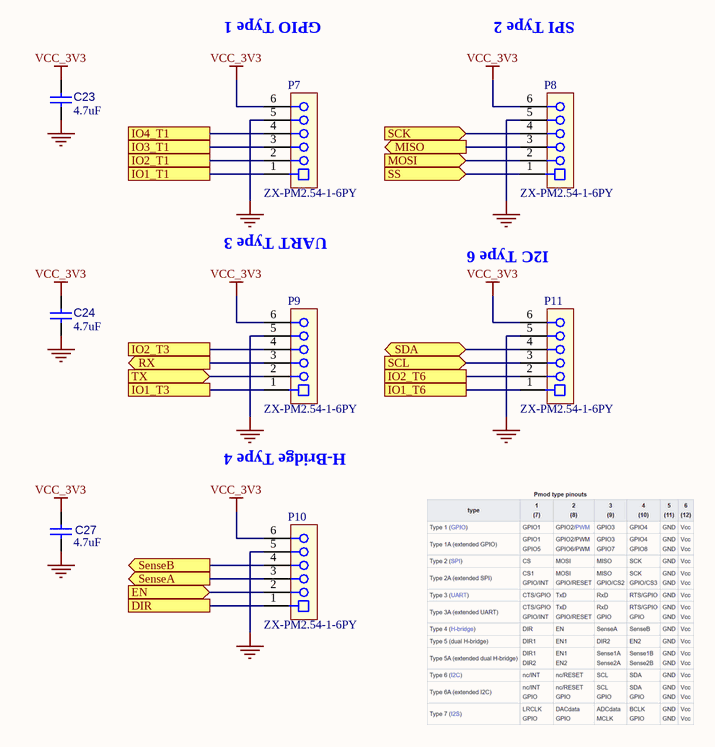
[diagram p5: PMOD-Connecteur.SchDoc]

### Parts
(Parts that share a designator on the sheet are numbered #1, #2 ... from top to bottom, then left to right.)
C23  value 4.7uF  [C_2012[0805]]  (hidden comment: Cap 4.7uF 0805)
C24  value 4.7uF  [C_2012[0805]]  (hidden comment: Cap 4.7uF 0805)
C27#1  value 4.7uF  [C_2012[0805]]  (hidden comment: Cap 4.7uF 0805)
P7#1  ZX-PM2.54-1-6PY  [CONN_SKT_01X06_100MIL]
P8#1  ZX-PM2.54-1-6PY  [CONN_SKT_01X06_100MIL]
P9  ZX-PM2.54-1-6PY  [CONN_SKT_01X06_100MIL]
P10  ZX-PM2.54-1-6PY  [CONN_SKT_01X06_100MIL]
P11  ZX-PM2.54-1-6PY  [CONN_SKT_01X06_100MIL]

### Ports
DIR (see PCB-Support-STM32F407[3C]), EN (in, see PCB-Support-STM32F407[3C]), IO1_T1 (see PCB-Support-STM32F407[3B]), IO1_T3 (see PCB-Support-STM32F407[3B]), IO1_T6 (see PCB-Support-STM32F407[3B]), IO2_T1 (see PCB-Support-STM32F407[3B]), IO2_T3 (see PCB-Support-STM32F407[3B]), IO2_T6 (see PCB-Support-STM32F407[3B]), IO3_T1 (see PCB-Support-STM32F407[3B]), IO4_T1 (see PCB-Support-STM32F407[3B]), MISO (out, see PCB-Support-STM32F407[3B]), MOSI (in, see PCB-Support-STM32F407[3B]), RX (out, see PCB-Support-STM32F407[3B]), SCK (in, see PCB-Support-STM32F407[3B]), SCL (in, see PCB-Support-STM32F407[3B], MikroBus-Connecteur[3C]), SDA (bidir, see PCB-Support-STM32F407[3B], MikroBus-Connecteur[3C]), SenseA (out, see PCB-Support-STM32F407[3C]), SenseB (out, see PCB-Support-STM32F407[3C]), SS (in, see PCB-Support-STM32F407[3B]), TX (in, see PCB-Support-STM32F407[3B])

### Nets
GND: C23.1 C24.1 C27#1.1 P7#1.5 P8#1.5 P9.5 P10.5 P11.5
VCC_3V3: C23.2 C24.2 C27#1.2 P7#1.6 P8#1.6 P9.6 P10.6 P11.6
PA5/SPI1-CLK: P8#1.4 ; port SCK
PA6/SPI1-MISO: P8#1.3 ; port MISO
PA7/SPI1-MOSI: P8#1.2 ; port MOSI
PA8/I2C3-SCL: P11.3 ; port SCL
PA15/D3: P7#1.4 ; port IO4_T1
PB0/D1: P9.4 ; port IO2_T3
PB5/D0: P7#1.1 ; port IO1_T1
PB7/D1: P7#1.2 ; port IO2_T1
PB14/D2: P11.1 ; port IO1_T6
PC4/D0: P9.1 ; port IO1_T3
PC8/D3: P11.2 ; port IO2_T6
PC9/I2C3-SDA: P11.4 ; port SDA
PC11/D2: P7#1.3 ; port IO3_T1
PD12: P10.2 ; port EN
PD13: P10.1 ; port DIR
PD14: P10.4 ; port SenseB
PD15: P10.3 ; port SenseA
PE0/CS_B: P8#1.1 ; port SS
PMOD-RX: P9.3 ; port RX
PMOD-TX: P9.2 ; port TX

### Notes on the sheet
- GPIO Type 1
- SPI Type 2
- UART Type 3
- I2C Type 6
- H-Bridge Type 4
- Titre :
- Conception :
- Date :
- Approbation :
- Heure :
- Révision :
- Feuille
- de
- Fichier :

### Library data of the parts
C23 C24 C27#1 = CAP003: as C16 on sheet MikroBus-Connecteur; Supplier 1: LCSC; Supplier Part Number 1: C163186; Mounting Technology: SMT
P7#1 P8#1 P9-P11 = CONN-100MIL-SKT-01X06: CONN SOCKET 6pos 100mils; Manufacturer 1: Megastar; Mounting Technology: TH; Manufacturer Part Number 1: ZX-PM2.54-1-6PY; Supplier 1: LCSC; Supplier Part Number 1: C7499326

## Sheet Affichage-LCD.SchDoc: Affichage LCD
size Letter; ApprovedBy: kc; Author: CEGEP Limoilou; Organization: Cegep Limoilou; Address1: 1300, 8e Avenue; Address2: Québec, QC; Address3: Canada; Address4: G1J 5L5; SheetNumber: 7; SheetTotal: 10
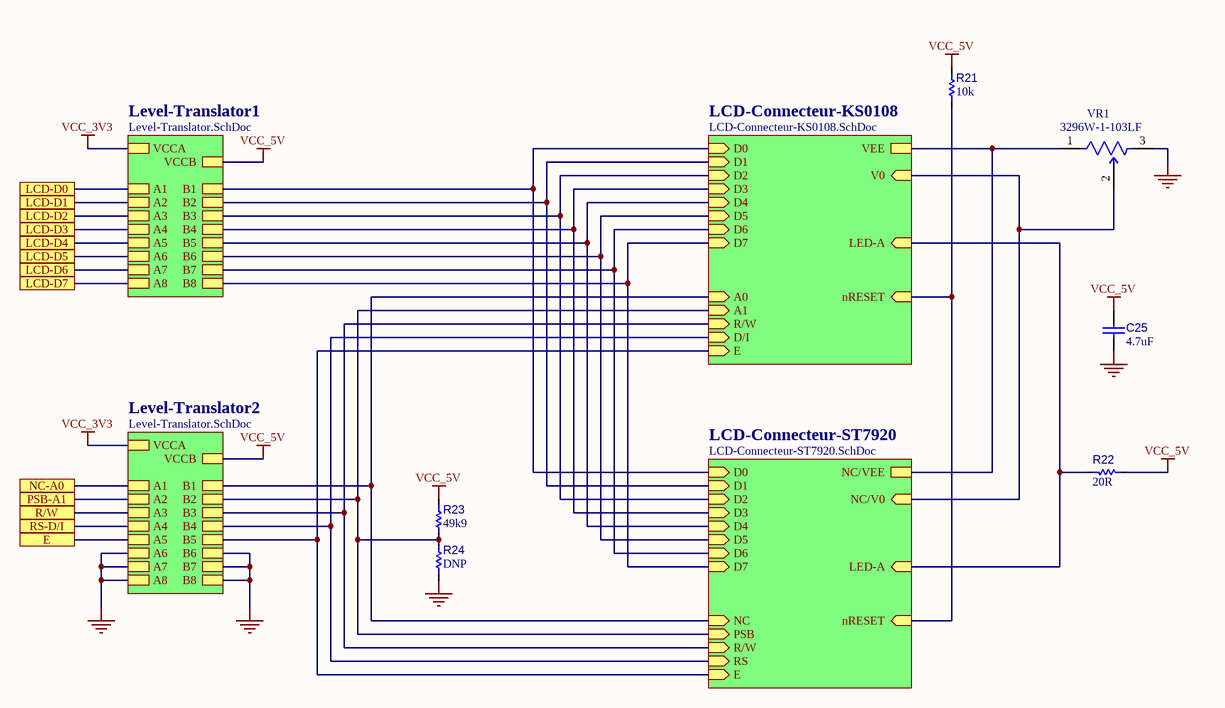
[diagram p6: Affichage-LCD.SchDoc]

### Parts
(Parts that share a designator on the sheet are numbered #1, #2 ... from top to bottom, then left to right.)
C25#2  value 4.7uF  [C_2012[0805]]  (hidden comment: Cap 4.7uF 0805)
R21  value 10k  [R_1005[0402]]  (hidden comment: Res 10k 1% 0402)
R22  value 20R  [R_3216[1206]]  (hidden comment: Res 20R 1206)
R23  value 49k9  [R_1005[0402]]  (hidden comment: Res 49k9 1% 0402)
R24  value DNP  [R_1005[0402]]  (hidden comment: Res 49k9 1% 0402)  (no BOM)
VR1  3296W-1-103LF  [R-POT-TH-TOP]

### Sub-sheets
LCD-Connecteur-KS0108 = LCD-Connecteur-KS0108.SchDoc: D0 (in), D1 (in), D2 (in), D3 (in), D4 (in), D5 (in), D6 (in), D7 (in), A0 (in), LED-A (in), A1 (in), V0 (in), E (in), nRESET (in), VEE, R/W (in), D/I (in)
LCD-Connecteur-ST7920 = LCD-Connecteur-ST7920.SchDoc: NC/V0 (in), RS (in), R/W (in), E (in), D0 (in), D1 (in), D2 (in), D3 (in), D4 (in), D5 (in), D6 (in), D7 (in), NC (in), PSB (in), LED-A (in), nRESET (in), NC/VEE
Level-Translator1 = Level-Translator.SchDoc: A1, B1, A2, A3, A4, A5, A6, A7, A8, B2, B3, B4, B5, B6, B7, B8, VCCA, VCCB
Level-Translator2 = Level-Translator.SchDoc: A1, B1, A2, A3, A4, A5, A6, A7, A8, B2, B3, B4, B5, B6, B7, B8, VCCA, VCCB

### Ports
E (see PCB-Support-STM32F407[3D]), LCD-D0 (see PCB-Support-STM32F407[3D]), LCD-D1 (see PCB-Support-STM32F407[3D]), LCD-D2 (see PCB-Support-STM32F407[3D]), LCD-D3 (see PCB-Support-STM32F407[3D]), LCD-D4 (see PCB-Support-STM32F407[3D]), LCD-D5 (see PCB-Support-STM32F407[3D]), LCD-D6 (see PCB-Support-STM32F407[3D]), LCD-D7 (see PCB-Support-STM32F407[3D]), NC-A0 (see PCB-Support-STM32F407[3D]), PSB-A1 (see PCB-Support-STM32F407[3D]), R/W (see PCB-Support-STM32F407[3D]), RS-D/I (see PCB-Support-STM32F407[3D])

### Nets
GND: C25#2.1 R24.1 VR1.3(CW) ; sheet Level-Translator2/A6, sheet Level-Translator2/A7, sheet Level-Translator2/A8, sheet Level-Translator2/B6, sheet Level-Translator2/B7, sheet Level-Translator2/B8
VCC_3V3: sheet Level-Translator1/VCCA, sheet Level-Translator2/VCCA
VCC_5V: C25#2.2 R21.2 R22.1 R23.2 ; sheet Level-Translator1/VCCB, sheet Level-Translator2/VCCB
PB8/CS0: port E, sheet Level-Translator2/A5
PD7/A0: port NC-A0, sheet Level-Translator2/A1
PD9/A1: port PSB-A1, sheet Level-Translator2/A2
PD10/A2: port R/W, sheet Level-Translator2/A3
PD11/A3: port RS-D/I, sheet Level-Translator2/A4
PE8/D0: port LCD-D0, sheet Level-Translator1/A1
PE9/D1: port LCD-D1, sheet Level-Translator1/A2
PE10/D2: port LCD-D2, sheet Level-Translator1/A3
PE11/D3: port LCD-D3, sheet Level-Translator1/A4
PE12/D4: port LCD-D4, sheet Level-Translator1/A5
PE13/D5: port LCD-D5, sheet Level-Translator1/A6
PE14/D6: port LCD-D6, sheet Level-Translator1/A7
PE15/D7: port LCD-D7, sheet Level-Translator1/A8
NetP8#2_3: VR1.2(WIPER) ; sheet LCD-Connecteur-KS0108/V0, sheet LCD-Connecteur-ST7920/NC/V0
NetP8#2_4: sheet LCD-Connecteur-KS0108/D0, sheet LCD-Connecteur-ST7920/D0, sheet Level-Translator1/B1
NetP8#2_5: sheet LCD-Connecteur-KS0108/D1, sheet LCD-Connecteur-ST7920/D1, sheet Level-Translator1/B2
NetP8#2_6: sheet LCD-Connecteur-KS0108/D2, sheet LCD-Connecteur-ST7920/D2, sheet Level-Translator1/B3
NetP8#2_7: sheet LCD-Connecteur-KS0108/D3, sheet LCD-Connecteur-ST7920/D3, sheet Level-Translator1/B4
NetP8#2_8: sheet LCD-Connecteur-KS0108/D4, sheet LCD-Connecteur-ST7920/D4, sheet Level-Translator1/B5
NetP8#2_9: sheet LCD-Connecteur-KS0108/D5, sheet LCD-Connecteur-ST7920/D5, sheet Level-Translator1/B6
NetP8#2_10: sheet LCD-Connecteur-KS0108/D6, sheet LCD-Connecteur-ST7920/D6, sheet Level-Translator1/B7
NetP8#2_11: sheet LCD-Connecteur-KS0108/D7, sheet LCD-Connecteur-ST7920/D7, sheet Level-Translator1/B8
NetP8#2_12: sheet LCD-Connecteur-KS0108/A0, sheet LCD-Connecteur-ST7920/NC, sheet Level-Translator2/B1
NetP8#2_13: R23.1 R24.2 ; sheet LCD-Connecteur-KS0108/A1, sheet LCD-Connecteur-ST7920/PSB, sheet Level-Translator2/B2
NetP8#2_14: R21.1 ; sheet LCD-Connecteur-KS0108/nRESET, sheet LCD-Connecteur-ST7920/nRESET
NetP8#2_15: sheet LCD-Connecteur-KS0108/R/W, sheet LCD-Connecteur-ST7920/R/W, sheet Level-Translator2/B3
NetP8#2_16: sheet LCD-Connecteur-KS0108/D/I, sheet LCD-Connecteur-ST7920/RS, sheet Level-Translator2/B4
NetP8#2_17: sheet LCD-Connecteur-KS0108/E, sheet LCD-Connecteur-ST7920/E, sheet Level-Translator2/B5
NetP8#2_18: VR1.1(CCW) ; sheet LCD-Connecteur-KS0108/VEE, sheet LCD-Connecteur-ST7920/NC/VEE
NetP8#2_19: R22.2 ; sheet LCD-Connecteur-KS0108/LED-A, sheet LCD-Connecteur-ST7920/LED-A

### Notes on the sheet
- Titre :
- Conception :
- Date :
- Approbation :
- Heure :
- Révision :
- Feuille
- de
- Fichier :

### Library data of the parts
C25#2 = CAP003: as C16 on sheet MikroBus-Connecteur; Supplier 1: LCSC; Supplier Part Number 1: C163186; Mounting Technology: SMT
R21 = RES003: as R9 on sheet PCB-Support-STM32F407; Tolerance: 1%; Mounting Technology: SMT; Supplier 1: Digikey; Supplier Part Number 1: 541-10.0KLCT-ND
R22 = RES020: Resistor type 1; Manufacturer 1: Yageo; Manufacturer Part Number 1: RC1206FR-0720RL; LibRef: RES020; CEGEP: RESI00020SMT; Tolerance: 1%; Puissance: 1/4W; Max Working Voltage: 200V; Mounting Technology: SMT; Supplier 1: LCSC; Supplier Part Number 1: C114941
R23 R24 = RES026: Resistor type 1; Manufacturer 1: Yageo; Manufacturer Part Number 1: RC0402FR-0749k9L; LibRef: RES026; Puissance: 1/16W; Max Working Voltage: 50V; Tolerance: 1%; Mounting Technology: SMT; Supplier 1: LCSC; Supplier Part Number 1: C137969
VR1 = RP-POT10K-MULTI-TURN-TOP-TH: TRIMMER 10K OHM 0.5W PC PIN TOP; Manufacturer 1: JIERR; Manufacturer Part Number 1: 3296W-1-103LF; Mounting Technology: TH; Manufacturer 2: BOURNS; Manufacturer Part Number 2: 3296W-1-103LF; Supplier 1: LCSC; Supplier 2: LCSC; Supplier Part Number 1: C49190453; Supplier Part Number 2: C34846

## Sheet LCD-Connecteur-KS0108.SchDoc: LCD - Connecteurs
size Letter; ApprovedBy: kc; Author: CEGEP Limoilou; Organization: Cegep Limoilou; Address1: 1300, 8e Avenue; Address2: Québec, QC; Address3: Canada; Address4: G1J 5L5; SheetNumber: 10; SheetTotal: 10
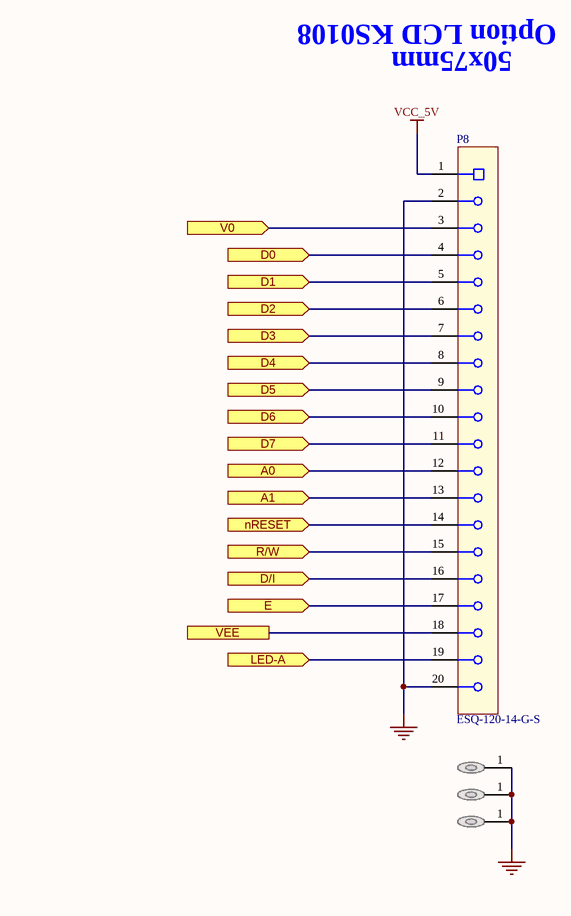
[diagram p7: LCD-Connecteur-KS0108.SchDoc]

### Parts
(Parts that share a designator on the sheet are numbered #1, #2 ... from top to bottom, then left to right.)
MH6  DNP  [MP_M-Hole_M2.5x0.45mm_LOOSE-FIT]  (value not drawn)  (no BOM)
MH7  DNP  [MP_M-Hole_M2.5x0.45mm_LOOSE-FIT]  (value not drawn)  (no BOM)
MH8  DNP  [MP_M-Hole_M2.5x0.45mm_LOOSE-FIT]  (value not drawn)  (no BOM)
P8#2  ESQ-120-14-G-S  [CONN-SKT-20POS-100MIL]  (no BOM)

### Ports
A0 (in, see Affichage-LCD[3B]), A1 (in, see Affichage-LCD[3B]), D0 (in, see Affichage-LCD[3B], LCD-Connecteur-ST7920[2B]), D1 (in, see Affichage-LCD[3B], LCD-Connecteur-ST7920[2B]), D2 (in, see Affichage-LCD[3B], LCD-Connecteur-ST7920[2B]), D3 (in, see Affichage-LCD[3B], LCD-Connecteur-ST7920[2B]), D4 (in, see Affichage-LCD[3B], LCD-Connecteur-ST7920[2B]), D5 (in, see Affichage-LCD[3B], LCD-Connecteur-ST7920[2C]), D6 (in, see Affichage-LCD[3B], LCD-Connecteur-ST7920[2C]), D7 (in, see Affichage-LCD[3B], LCD-Connecteur-ST7920[2C]), D/I (in, see Affichage-LCD[3B]), E (in, see Affichage-LCD[3B], LCD-Connecteur-ST7920[2B]), LED-A (in, see Affichage-LCD[3B], LCD-Connecteur-ST7920[2C]), nRESET (in, see Affichage-LCD[3B], LCD-Connecteur-ST7920[2C]), R/W (in, see Affichage-LCD[3B], LCD-Connecteur-ST7920[2B]), V0 (in, see Affichage-LCD[3B]), VEE (see Affichage-LCD[3B])

### Nets
GND: MH6.1 MH7.1 MH8.1 P8#2.2 P8#2.20
VCC_5V: P8#2.1
NetP8#2_3: P8#2.3 ; port V0
NetP8#2_4: P8#2.4 ; port D0
NetP8#2_5: P8#2.5 ; port D1
NetP8#2_6: P8#2.6 ; port D2
NetP8#2_7: P8#2.7 ; port D3
NetP8#2_8: P8#2.8 ; port D4
NetP8#2_9: P8#2.9 ; port D5
NetP8#2_10: P8#2.10 ; port D6
NetP8#2_11: P8#2.11 ; port D7
NetP8#2_12: P8#2.12 ; port A0
NetP8#2_13: P8#2.13 ; port A1
NetP8#2_14: P8#2.14 ; port nRESET
NetP8#2_15: P8#2.15 ; port R/W
NetP8#2_16: P8#2.16 ; port D/I
NetP8#2_17: P8#2.17 ; port E
NetP8#2_18: P8#2.18 ; port VEE
NetP8#2_19: P8#2.19 ; port LED-A

### Notes on the sheet
- Option LCD KS0108
- 50x75mm
- Titre :
- Conception :
- Date :
- Approbation :
- Heure :
- Révision :
- Feuille
- de
- Fichier :

### Library data of the parts
MH6-MH8 = MH-2.5MM: Mounting Hole 2.5mm w/ Flat Washer; Manufacturer Part Number 1: DNP; Value: DNP; Supplier Part Number 1: N/A
P8#2 = CONN-100MIL-SKT-01X20: CONN SOCKET 20POS 2.54MM; Manufacturer 1: Megastar; Manufacturer Part Number 1: ZX-PM2.54-1-20PY; Code CEGEP: KCONDIV0053; Localisation: R13-B035; Mounting Technology: TH; Supplier 1: LCSC; Supplier Part Number 1: C7499336

## Sheet LCD-Connecteur-ST7920.SchDoc: LCD - Connecteurs
size Letter; ApprovedBy: kc; Author: CEGEP Limoilou; Organization: Cegep Limoilou; Address1: 1300, 8e Avenue; Address2: Québec, QC; Address3: Canada; Address4: G1J 5L5; SheetNumber: 9; SheetTotal: 10
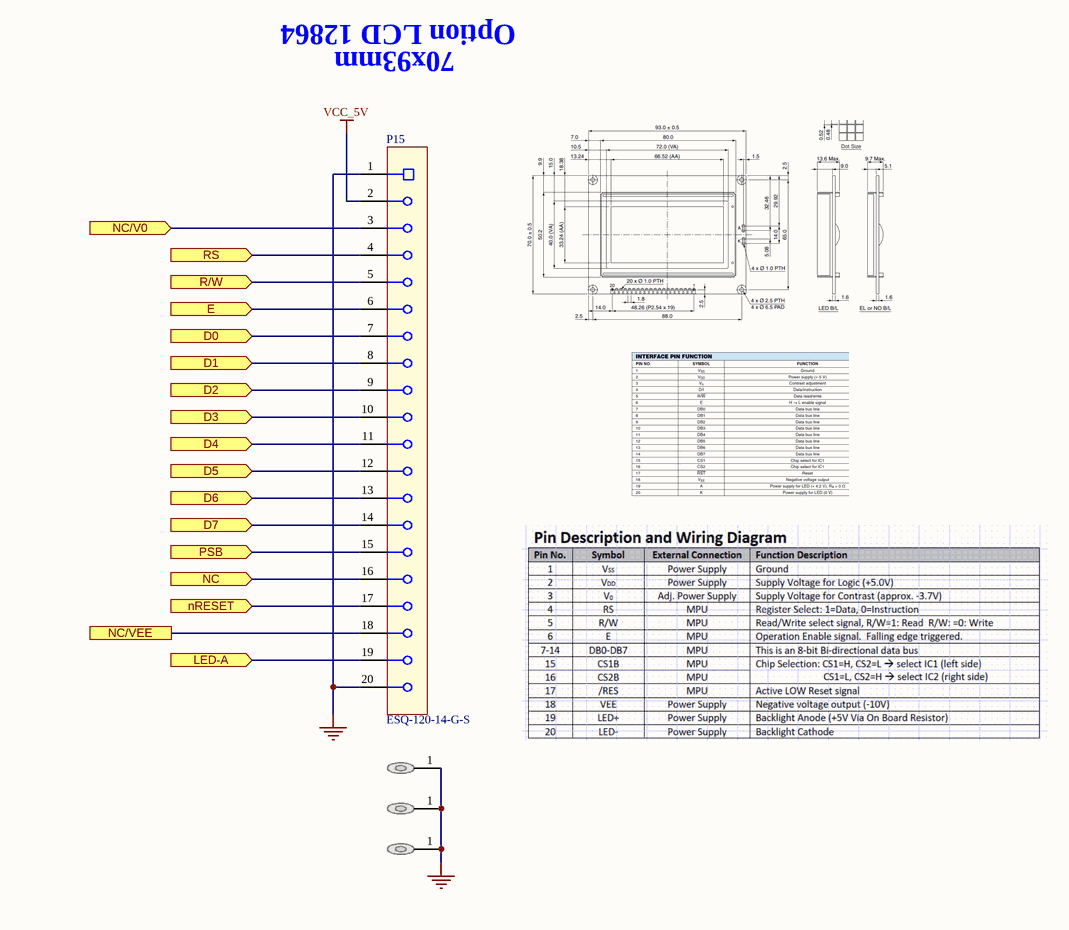
[diagram p8: LCD-Connecteur-ST7920.SchDoc]

### Parts
MH9  DNP  [MP_M-Hole_M2.5x0.45mm_LOOSE-FIT]  (value not drawn)  (no BOM)
MH10  DNP  [MP_M-Hole_M2.5x0.45mm_LOOSE-FIT]  (value not drawn)  (no BOM)
MH11  DNP  [MP_M-Hole_M2.5x0.45mm_LOOSE-FIT]  (value not drawn)  (no BOM)
P15  ESQ-120-14-G-S  [CONN-SKT-20POS-100MIL]

### Ports
D0 (in, see Affichage-LCD[3C], LCD-Connecteur-KS0108[2B]), D1 (in, see Affichage-LCD[3C], LCD-Connecteur-KS0108[2B]), D2 (in, see Affichage-LCD[3C], LCD-Connecteur-KS0108[2B]), D3 (in, see Affichage-LCD[3C], LCD-Connecteur-KS0108[2B]), D4 (in, see Affichage-LCD[3C], LCD-Connecteur-KS0108[2B]), D5 (in, see Affichage-LCD[3C], LCD-Connecteur-KS0108[2B]), D6 (in, see Affichage-LCD[3C], LCD-Connecteur-KS0108[2B]), D7 (in, see Affichage-LCD[3C], LCD-Connecteur-KS0108[2B]), E (in, see Affichage-LCD[3D], LCD-Connecteur-KS0108[2C]), LED-A (in, see Affichage-LCD[3C], LCD-Connecteur-KS0108[2C]), NC (in, see Affichage-LCD[3C]), NC/V0 (in, see Affichage-LCD[3C]), NC/VEE (see Affichage-LCD[3C]), nRESET (in, see Affichage-LCD[3C], LCD-Connecteur-KS0108[2C]), PSB (in, see Affichage-LCD[3C]), R/W (in, see Affichage-LCD[3C], LCD-Connecteur-KS0108[2C]), RS (in, see Affichage-LCD[3D])

### Nets
GND: MH9.1 MH10.1 MH11.1 P15.1 P15.20
VCC_5V: P15.2
NetP8#2_3: P15.3 ; port NC/V0
NetP8#2_4: P15.7 ; port D0
NetP8#2_5: P15.8 ; port D1
NetP8#2_6: P15.9 ; port D2
NetP8#2_7: P15.10 ; port D3
NetP8#2_8: P15.11 ; port D4
NetP8#2_9: P15.12 ; port D5
NetP8#2_10: P15.13 ; port D6
NetP8#2_11: P15.14 ; port D7
NetP8#2_12: P15.16 ; port NC
NetP8#2_13: P15.15 ; port PSB
NetP8#2_14: P15.17 ; port nRESET
NetP8#2_15: P15.5 ; port R/W
NetP8#2_16: P15.4 ; port RS
NetP8#2_17: P15.6 ; port E
NetP8#2_18: P15.18 ; port NC/VEE
NetP8#2_19: P15.19 ; port LED-A

### Notes on the sheet
- Option LCD 12864
- 70x93mm
- Titre :
- Conception :
- Date :
- Approbation :
- Heure :
- Révision :
- Feuille
- de
- Fichier :

### Library data of the parts
MH9-MH11 = MH-2.5MM: Mounting Hole 2.5mm w/ Flat Washer; Manufacturer Part Number 1: DNP; Value: DNP; Supplier Part Number 1: N/A
P15 = CONN-100MIL-SKT-01X20: as P8#2 on sheet LCD-Connecteur-KS0108; Mounting Technology: TH; Supplier 1: LCSC; Supplier Part Number 1: C7499336

## Sheet Level-Translator.SchDoc: Bidir Level Translator
size Letter; ApprovedBy: kc; Author: CEGEP Limoilou; Organization: Cegep Limoilou; Address1: 1300, 8e Avenue; Address2: Québec, QC; Address3: Canada; Address4: G1J 5L5; SheetNumber: 8; SheetTotal: 10
Used 2 times, as channels Affichage-LCD/Level-Translator1, Affichage-LCD/Level-Translator2. Parts and nets are listed once, with the designators drawn on the sheet.
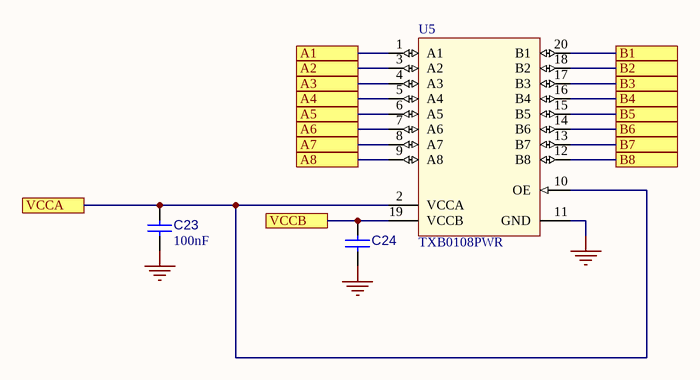
[diagram p9: Level-Translator.SchDoc]

### Parts
C23  value 100nF  [C_1005[0402]]  (hidden comment: Cap 100nF 0402)
C24  Cap 100nF 0402  [C_1005[0402]]  (value not drawn)
U5  TXB0108PWR  [U_TSSOP65P660X450-20]

### Ports
A1 (see Affichage-LCD[1B]), A2 (see Affichage-LCD[1B]), A3 (see Affichage-LCD[1B]), A4 (see Affichage-LCD[1B]), A5 (see Affichage-LCD[1B]), A6 (see Affichage-LCD[1B]), A7 (see Affichage-LCD[1B]), A8 (see Affichage-LCD[1B]), B1 (see Affichage-LCD[1B]), B2 (see Affichage-LCD[1B]), B3 (see Affichage-LCD[1B]), B4 (see Affichage-LCD[1B]), B5 (see Affichage-LCD[1B]), B6 (see Affichage-LCD[1B]), B7 (see Affichage-LCD[1B]), B8 (see Affichage-LCD[1B]), VCCA (see Affichage-LCD[1B]), VCCB (see Affichage-LCD[1B])

### Nets
GND: C23.1 C24.1 U5.11(GND)
A1: U5.1(A1) ; port A1
A2: U5.3(A2) ; port A2
A3: U5.4(A3) ; port A3
A4: U5.5(A4) ; port A4
A5: U5.6(A5) ; port A5
A6: U5.7(A6) ; port A6
A7: U5.8(A7) ; port A7
A8: U5.9(A8) ; port A8
B1: U5.20(B1) ; port B1
B2: U5.18(B2) ; port B2
B3: U5.17(B3) ; port B3
B4: U5.16(B4) ; port B4
B5: U5.15(B5) ; port B5
B6: U5.14(B6) ; port B6
B7: U5.13(B7) ; port B7
B8: U5.12(B8) ; port B8
VCCA: C23.2 U5.2(VCCA) U5.10(OE) ; port VCCA
VCCB: C24.2 U5.19(VCCB) ; port VCCB

### Channels
Affichage-LCD/Level-Translator1: designators end in A; ports A1=PE8/D0 A2=PE9/D1 A3=PE10/D2 A4=PE11/D3 A5=PE12/D4 A6=PE13/D5 A7=PE14/D6 A8=PE15/D7 B1=NetP8#2_4 B2=NetP8#2_5 B3=NetP8#2_6 B4=NetP8#2_7 B5=NetP8#2_8 B6=NetP8#2_9 B7=NetP8#2_10 B8=NetP8#2_11 VCCA=VCC_3V3 VCCB=VCC_5V
Affichage-LCD/Level-Translator2: designators end in B; ports A1=PD7/A0 A2=PD9/A1 A3=PD10/A2 A4=PD11/A3 A5=PB8/CS0 A6=GND A7=GND A8=GND B1=NetP8#2_12 B2=NetP8#2_13 B3=NetP8#2_15 B4=NetP8#2_16 B5=NetP8#2_17 B6=GND B7=GND B8=GND VCCA=VCC_3V3 VCCB=VCC_5V

### Notes on the sheet
- Titre :
- Conception :
- Date :
- Approbation :
- Heure :
- Révision :
- Feuille
- de
- Fichier :

### Library data of the parts
C23 C24 = CAP001: as C2 on sheet USB; Mounting Technology: SMT; Supplier 1: LCSC; Supplier Part Number 1: C2167491
U5 = U_TXB0108PWR: IC 8-Bit Bidirectional Voltage-Level Translator with Auto-Direction Sensing 20-Pin TSSOP (PW); Manufacturer 1: Texas Instruments; Mounting Technology: SMT; Manufacturer Part Number 1: TXB0108PWR; Supplier 1: LCSC; Supplier Part Number 1: C53406